# Altium project cm4gateway.PrjPcb (part 1 of 2)
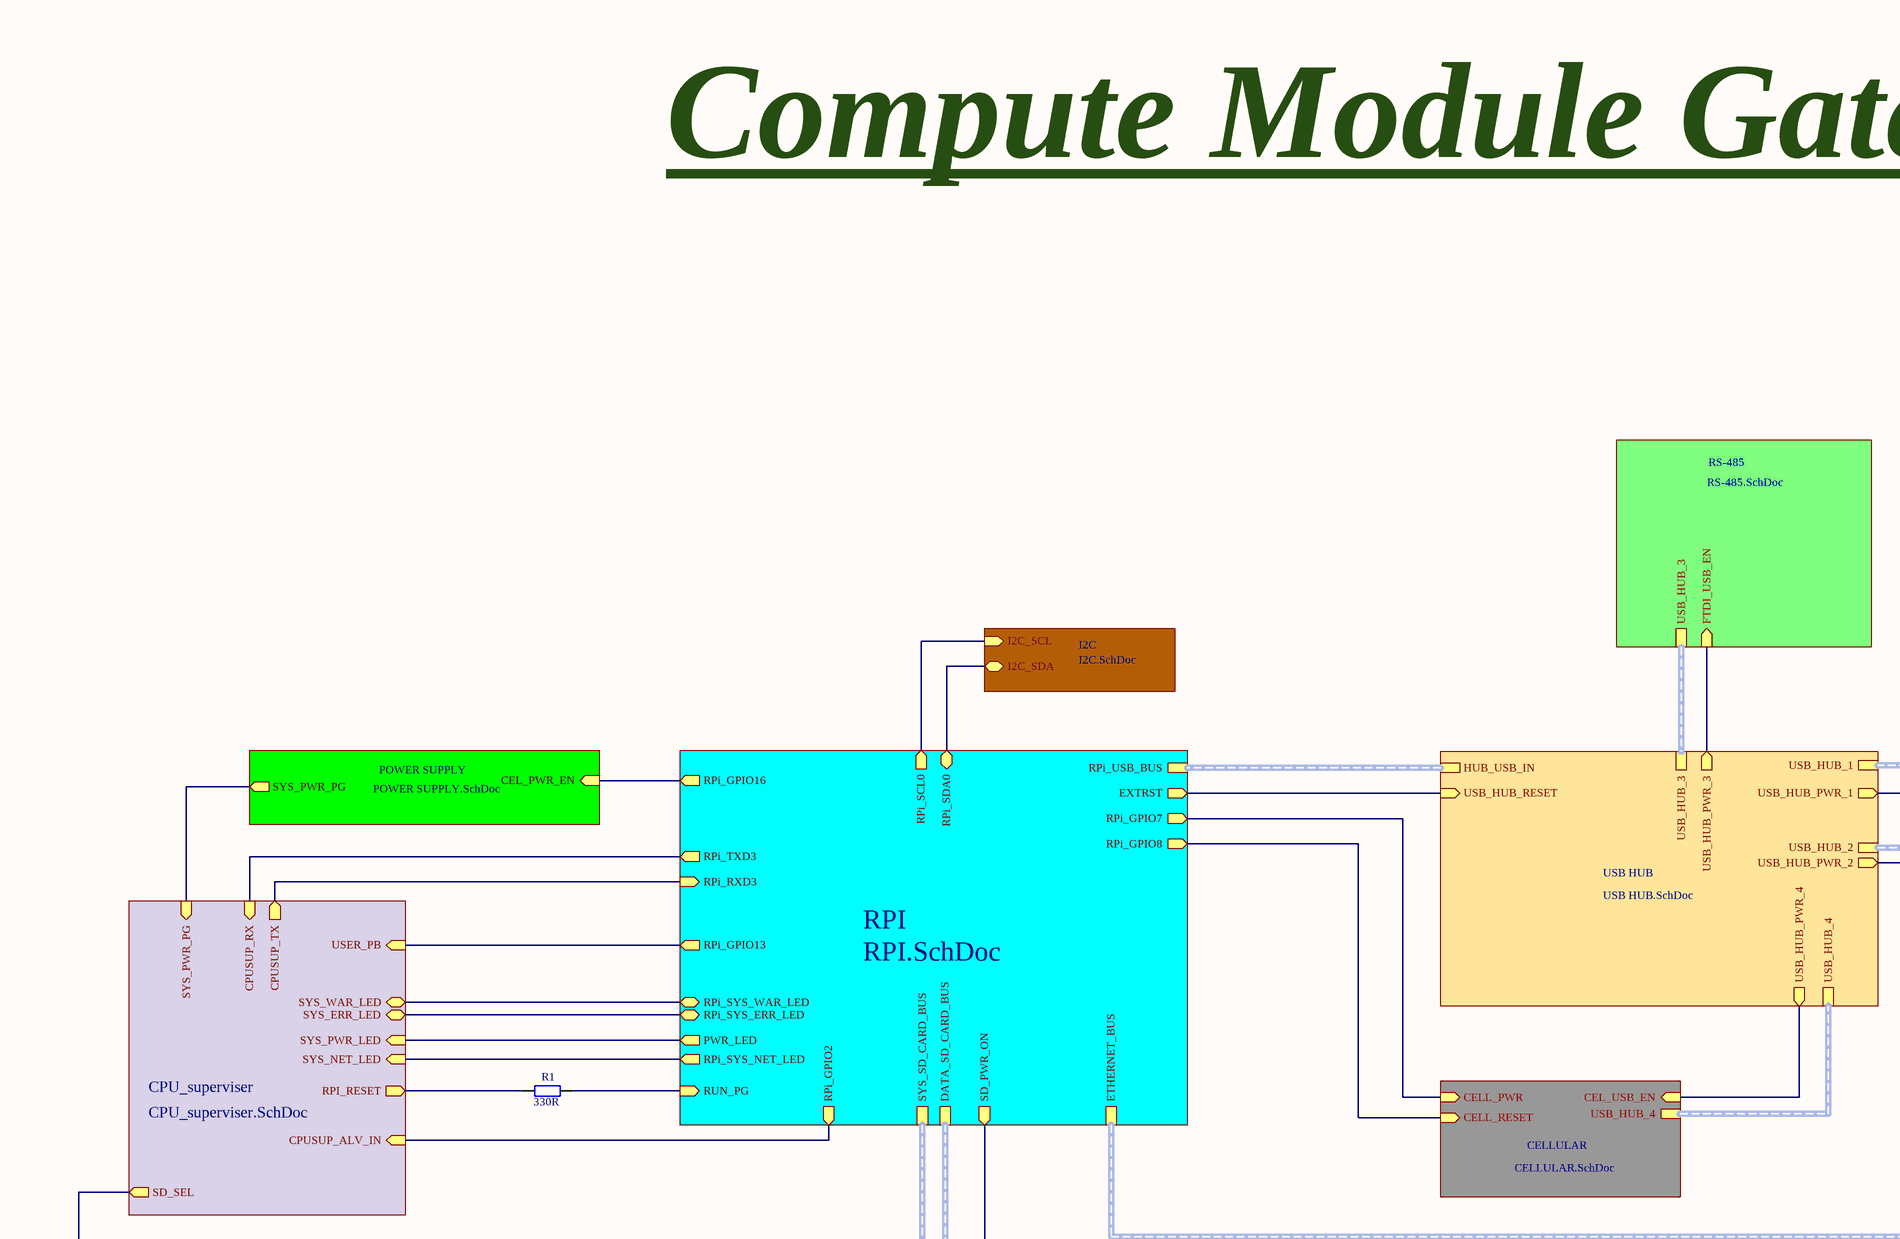
[diagram p0: cm4gateway.SchDoc, top left]
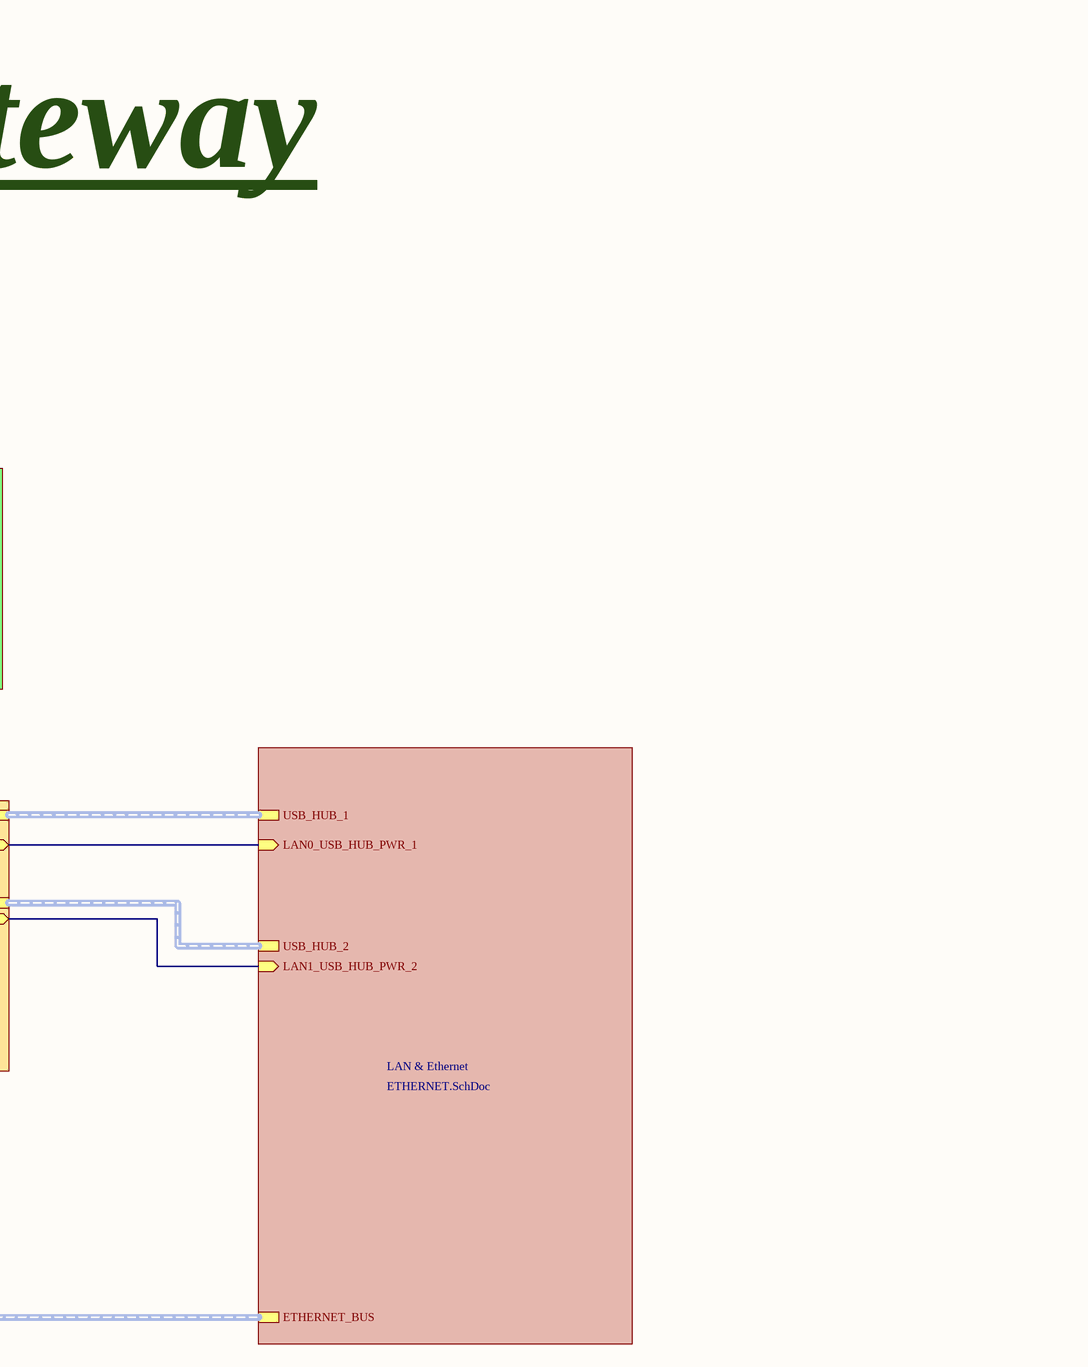
[diagram p1: cm4gateway.SchDoc, top right]
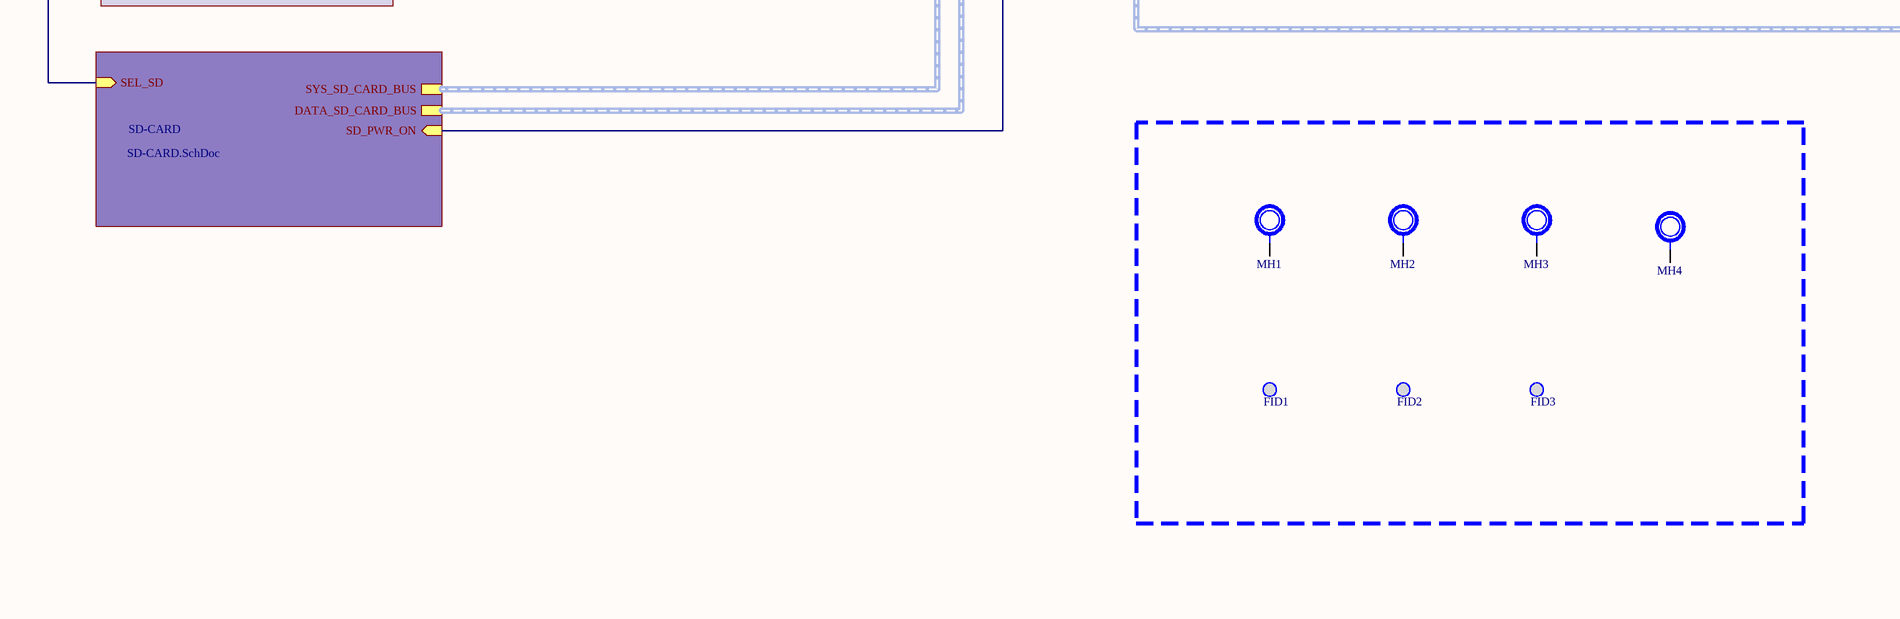
[diagram p2: cm4gateway.SchDoc, bottom left]
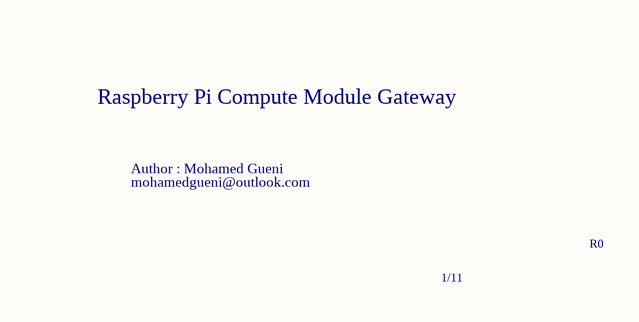
[diagram p3: cm4gateway.SchDoc, bottom right]
.Echelle: 1/1; .ENGINEER: M.GUENI; .PCB-TITLE: CM4G; .PCB Assembly Number: 1; .REVISION: R0
10 sheets, 359 parts. Net scope: hierarchical (ports join the sheet entries above them; power ports are global).
Board file: cm4gateway.PcbDoc
Sheets:
  cm4gateway.SchDoc
    CELLULAR = CELLULAR.SchDoc
    USB HUB = USB HUB.SchDoc
    POWER SUPPLY = POWER SUPPLY.SchDoc
    RS-485 = RS-485.SchDoc
    SD-CARD = SD-CARD.SchDoc
    CPU_superviser = CPU_superviser.SchDoc
    RPI = RPI.SchDoc
    I2C = I2C.SchDoc
    LAN & Ethernet = ETHERNET.SchDoc

## Sheet cm4gateway.SchDoc
size D

### Parts
FID1  Fiducial  [FIDUCIAL-1MM]  (value not drawn)
FID2  Fiducial  [FIDUCIAL-1MM]  (value not drawn)
FID3  Fiducial  [FIDUCIAL-1MM]  (value not drawn)
MH1  MH  [MH]  (value not drawn)
MH2  MH  [MH]  (value not drawn)
MH3  MH  [MH]  (value not drawn)
MH4  MH  [MH]  (value not drawn)
R1  Value 1: 330R  [RESC1608N]  (hidden comment: Resistor)

### Sub-sheets
CELLULAR = CELLULAR.SchDoc: USB_HUB_4 (harness USB_HUB_4), CEL_USB_EN (in), CELL_PWR (in), CELL_RESET (in)
CPU_superviser = CPU_superviser.SchDoc: CPUSUP_RX (in), CPUSUP_TX (out), USER_PB (in), SYS_ERR_LED (bidir), SYS_WAR_LED (bidir), CPUSUP_ALV_IN (in), RPI_RESET (out), SYS_PWR_PG (in), SD_SEL (out), SYS_PWR_LED (in), SYS_NET_LED (in)
I2C = I2C.SchDoc: I2C_SCL (in), I2C_SDA (bidir)
LAN & Ethernet = ETHERNET.SchDoc: USB_HUB_1 (harness USB_HUB_1), LAN0_USB_HUB_PWR_1 (in), USB_HUB_2 (harness USB_HUB_2), LAN1_USB_HUB_PWR_2 (in), ETHERNET_BUS (harness ETHERNET_BUS)
POWER SUPPLY = POWER SUPPLY.SchDoc: CEL_PWR_EN (in), SYS_PWR_PG (out)
RPI = RPI.SchDoc: RPi_GPIO13 (out), RPi_SYS_WAR_LED (bidir), RPi_SYS_ERR_LED (bidir), PWR_LED (out), RPi_SYS_NET_LED (out), ETHERNET_BUS (harness ETHERNET_BUS), SD_PWR_ON (out), RPi_RXD3 (in), RPi_TXD3 (out), RPi_GPIO2 (out), RUN_PG (in), RPi_GPIO16 (out), RPi_USB_BUS (harness RPi_USB_BUS), EXTRST (out), RPi_GPIO8 (out), RPi_GPIO7 (out), RPi_SDA0 (bidir), RPi_SCL0 (out), DATA_SD_CARD_BUS (harness DATA_SD_CARD_BUS), SYS_SD_CARD_BUS (harness SYS_SD_CARD_BUS)
RS-485 = RS-485.SchDoc: USB_HUB_3 (harness USB_HUB_3), FTDI_USB_EN (in)
SD-CARD = SD-CARD.SchDoc: SYS_SD_CARD_BUS (harness SYS_SD_CARD_BUS), DATA_SD_CARD_BUS (harness DATA_SD_CARD_BUS), SD_PWR_ON (in), SEL_SD (in)
USB HUB = USB HUB.SchDoc: HUB_USB_IN (harness RPi_USB_BUS), USB_HUB_RESET (in), USB_HUB_1 (harness USB_HUB_1), USB_HUB_PWR_1 (out), USB_HUB_2 (harness USB_HUB_2), USB_HUB_PWR_2 (out), USB_HUB_3 (harness USB_HUB_3), USB_HUB_PWR_3 (out), USB_HUB_4 (harness USB_HUB_4), USB_HUB_PWR_4 (out)

### Nets
I2C_SCL: sheet RPI/RPi_SCL0, sheet I2C/I2C_SCL
I2C_SDA: sheet RPI/RPi_SDA0, sheet I2C/I2C_SDA
RESET_IN: sheet USB HUB/USB_HUB_RESET, sheet RPI/EXTRST
SEL_SD: sheet SD-CARD/SEL_SD, sheet CPU_superviser/SD_SEL
SYS_ERR_LED: sheet CPU_superviser/SYS_ERR_LED, sheet RPI/RPi_SYS_ERR_LED
SYS_NET_LED: sheet CPU_superviser/SYS_NET_LED, sheet RPI/RPi_SYS_NET_LED
SYS_PWR_LED: sheet CPU_superviser/SYS_PWR_LED, sheet RPI/PWR_LED
SYS_WAR_LED: sheet CPU_superviser/SYS_WAR_LED, sheet RPI/RPi_SYS_WAR_LED
USER_PB: sheet CPU_superviser/USER_PB, sheet RPI/RPi_GPIO13
NetQ1_6: R1.1 ; sheet CPU_superviser/RPI_RESET
NetR1_2: R1.2 ; sheet RPI/RUN_PG
NetR4_1: sheet POWER SUPPLY/CEL_PWR_EN, sheet RPI/RPi_GPIO16
NetR15_2: sheet POWER SUPPLY/SYS_PWR_PG, sheet CPU_superviser/SYS_PWR_PG
NetR43_1: sheet USB HUB/USB_HUB_PWR_3, sheet RS-485/FTDI_USB_EN
NetR60_2: sheet SD-CARD/SD_PWR_ON, sheet RPI/SD_PWR_ON
NetR101_2: sheet CELLULAR/CEL_USB_EN, sheet USB HUB/USB_HUB_PWR_4
NetR103_2: sheet CELLULAR/CELL_PWR, sheet RPI/RPi_GPIO7
NetR105_2: sheet CELLULAR/CELL_RESET, sheet RPI/RPi_GPIO8
NetTP37_1: sheet CPU_superviser/CPUSUP_RX, sheet RPI/RPi_TXD3
NetTP38_1: sheet CPU_superviser/CPUSUP_TX, sheet RPI/RPi_RXD3
NetU17_12: sheet USB HUB/USB_HUB_PWR_1, sheet LAN & Ethernet/LAN0_USB_HUB_PWR_1
NetU17_16: sheet USB HUB/USB_HUB_PWR_2, sheet LAN & Ethernet/LAN1_USB_HUB_PWR_2
NetU19_14: sheet CPU_superviser/CPUSUP_ALV_IN, sheet RPI/RPi_GPIO2

Not connected (* = marked no-connect by the designer): MH1 MH; MH2 MH; MH3 MH; MH4 MH

### Buses and harness runs
harness sheet CELLULAR/USB_HUB_4 = sheet USB HUB/USB_HUB_4
harness sheet LAN & Ethernet/ETHERNET_BUS = sheet RPI/ETHERNET_BUS
harness sheet LAN & Ethernet/USB_HUB_1 = sheet USB HUB/USB_HUB_1
harness sheet LAN & Ethernet/USB_HUB_2 = sheet USB HUB/USB_HUB_2
harness sheet RPI/DATA_SD_CARD_BUS = sheet SD-CARD/DATA_SD_CARD_BUS
harness sheet RPI/RPi_USB_BUS = sheet USB HUB/HUB_USB_IN
harness sheet RPI/SYS_SD_CARD_BUS = sheet SD-CARD/SYS_SD_CARD_BUS
harness sheet RS-485/USB_HUB_3 = sheet USB HUB/USB_HUB_3

### Notes on the sheet
- Compute Module Gateway
- Raspberry Pi Compute Module Gateway
- Author : Mohamed Gueni
- mohamedgueni@outlook.com
- 1/11
- R0
- DWG. NO.
- REV.
- SHT.
- REVISION
- DESCRIPTION
- DATE
- APPROVED
- THIS DOCUMENT AND THE DATA DISCLOSED HEREIN OR HEREWITH IS THE PROPERTY OF ALTIUM LIMITED AND MAY BE FREELY DISTRIBUTED IN WHOLE. NO RIGHTS ARE RESERVED OR EXPRESS OR IMPLIED WARANTEE GIVEN.
- ENG:
- DSN:
- APPROVALS
- PROJECT
- DOCUMENT REVISION:
- DESIGN ITEM:
- CHK:
- BOM:
- REFERENCE DOCUMENTS
- PROJECT REVISION:
- TITLE
- FAB DWG:
- PCB DWG:
- ASSY DWG:
- SCALE:
- SIZE
- C
- CAGE CODE
- FILE NAME
- DWG NO.
- SHEET
- OF
- REV

### Library data of the parts
FID1-FID3 = MIS-000000003: MAN: _; Value 1: 1mm; Part Number: MIS-000000003; MANREF: _; DES: _; Value 2: _; TOL: _; FTP: _; SUP: _; SUPREF: _; NOTE: _
MH1-MH4 = MIS-000000004: MAN: _; Part Number: MIS-000000004; MANREF: _; DES: _; Value 1: _; Value 2: _; TOL: _; NOTE: _
R1 = RES-000000008: MAN: KOA Speer; SUP: Mouser; NOTE: _; Part Number: RES-000000008

## Sheet CELLULAR.SchDoc
size A3
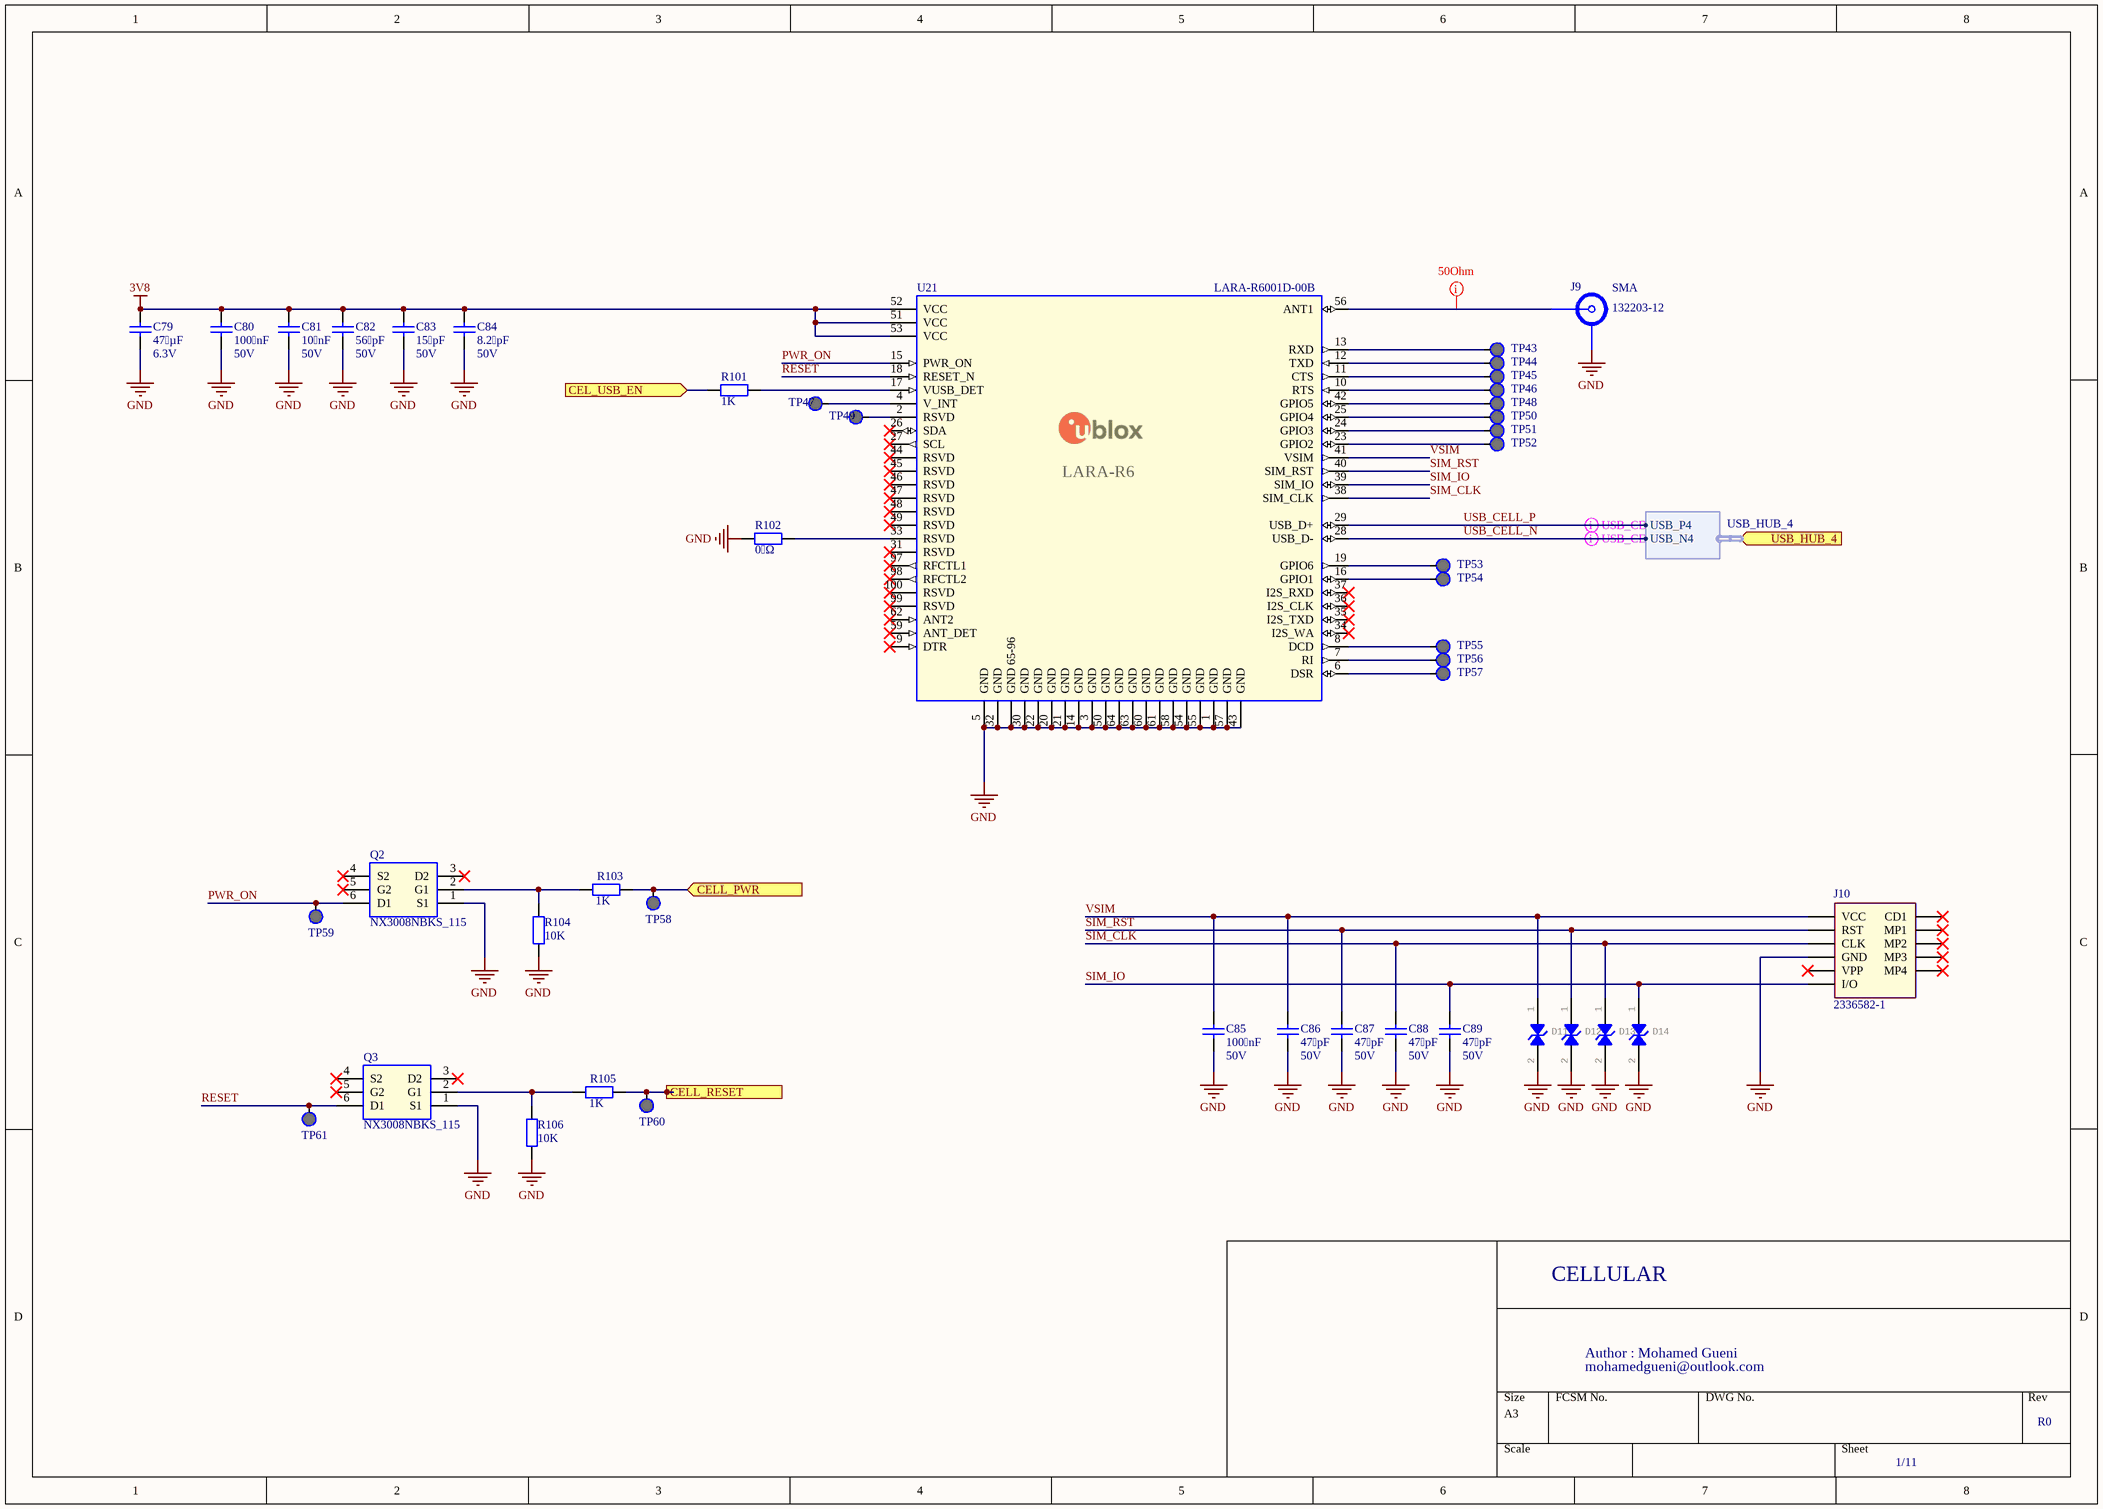
[diagram p4: CELLULAR.SchDoc]

### Parts
C79  Value 1: 47 µF  Value 2: 6.3V  [CAPC1210]  (hidden comment: T491D476K006AT)
C80  Value 1: 100 nF  Value 2: 50V  [CAPC1608N]  (hidden comment: GRM188R71H104KA93D)
C81  Value 1: 10 nF  Value 2: 50V  [CAPC1608N]  (hidden comment: GRM188R71H103KA01D)
C82  Value 1: 56 pF  Value 2: 50V  [CAPC402]  (hidden comment: KGM05ACG1H560KH)
C83  Value 1: 15 pF  Value 2: 50V  [CAPC1608N]  (hidden comment: GRM1885C1H150JA01D)
C84  Value 1: 8.2 pF  Value 2: 50V  [CAPC402]  (hidden comment: GRM1555C1H8R2CA01D)
C85  Value 1: 100 nF  Value 2: 50V  [CAPC1608N]  (hidden comment: GRM188R71H104KA93D)
C86  Value 1: 47 pF  Value 2: 50V  [CAPC402]  (hidden comment: C0402C470J5GAC)
C87  Value 1: 47 pF  Value 2: 50V  [CAPC402]  (hidden comment: C0402C470J5GAC)
C88  Value 1: 47 pF  Value 2: 50V  [CAPC402]  (hidden comment: C0402C470J5GAC)
C89  Value 1: 47 pF  Value 2: 50V  [CAPC402]  (hidden comment: C0402C470J5GAC)
D11  CDSOD323-T12LC  [CDSOD323T12LC]  (value not drawn)
D12  CDSOD323-T12LC  [CDSOD323T12LC]  (value not drawn)
D13  CDSOD323-T12LC  [CDSOD323T12LC]  (value not drawn)
D14  CDSOD323-T12LC  [CDSOD323T12LC]  (value not drawn)
J9  132203-12  [13220312]
J10  2336582-1  [23365821]
Q2  NX3008NBKS_115  [SOT65P210X110-6N]
Q3  NX3008NBKS_115  [SOT65P210X110-6N]
R101  Value 1: 1K  [RESC1608N]  (hidden comment: RN731JTTD1001F25)
R102  Value 1: 0 Ω  [RESC1608N]  (hidden comment: RMCF0603ZT0R00)
R103  Value 1: 1K  [RESC1608N]  (hidden comment: Resistor)
R104  Value 1: 10K  [RESC1608N]  (hidden comment: Resistor)
R105  Value 1: 1K  [RESC1608N]  (hidden comment: Resistor)
R106  Value 1: 10K  [RESC1608N]  (hidden comment: Resistor)
TP43  Test Point  [TP]  (value not drawn)  (no BOM)
TP44  Test Point  [TP]  (value not drawn)  (no BOM)
TP45  Test Point  [TP]  (value not drawn)  (no BOM)
TP46  Test Point  [TP]  (value not drawn)  (no BOM)
TP47  Test Point  [TP]  (value not drawn)  (no BOM)
TP48  Test Point  [TP]  (value not drawn)  (no BOM)
TP49  Test Point  [TP]  (value not drawn)  (no BOM)
TP50  Test Point  [TP]  (value not drawn)  (no BOM)
TP51  Test Point  [TP]  (value not drawn)  (no BOM)
TP52  Test Point  [TP]  (value not drawn)  (no BOM)
TP53  Test Point  [TP]  (value not drawn)  (no BOM)
TP54  Test Point  [TP]  (value not drawn)  (no BOM)
TP55  Test Point  [TP]  (value not drawn)  (no BOM)
TP56  Test Point  [TP]  (value not drawn)  (no BOM)
TP57  Test Point  [TP]  (value not drawn)  (no BOM)
TP58  Test Point  [TP]  (value not drawn)  (no BOM)
TP59  Test Point  [TP]  (value not drawn)  (no BOM)
TP60  Test Point  [TP]  (value not drawn)  (no BOM)
TP61  Test Point  [TP]  (value not drawn)  (no BOM)
U21  LARA-R6001D-00B  [LARA-R6]

### Ports
CEL_USB_EN (in), CELL_PWR (in), CELL_RESET (in), USB_HUB_4 (in, harness USB_HUB_4)

### Harnesses
USB_HUB_4: USB_P4, USB_N4

### Nets
3V8: C79.2 C80.1 C81.2 C82.2 C83.2 C84.2 U21.51(VCC) U21.52(VCC) U21.53(VCC)
GND: C79.1 C80.2 C81.1 C82.1 C83.1 C84.1 C85.2 C86.1 C87.1 C88.1 C89.1 D11.2 D12.2 D13.2 D14.2 J9.1,2,3,4 J10.C5(GND) Q2.1(S1) Q3.1(S1) R102.2 R104.1 R106.1 U21.1(GND) U21.3(GND) U21.5(GND) U21.14(GND) U21.20(GND) U21.21(GND) U21.22(GND) U21.30(GND) U21.32(GND) U21.43(GND) U21.50(GND) U21.54(GND) U21.55(GND) U21.57(GND) U21.58(GND) U21.60(GND) U21.61(GND) U21.63(GND) U21.64(GND) U21.65(GND_65-96)
PWR_ON: Q2.6(D1) TP59.1 U21.15(PWR_ON)
RESET: Q3.6(D1) TP61.1 U21.18(RESET_N)
SIM_CLK: C88.2 D13.1 J10.C3(CLK) U21.38(SIM_CLK)
SIM_IO: C89.2 D14.1 J10.C7(I/O) U21.39(SIM_IO)
SIM_RST: C87.2 D12.1 J10.C2(RST) U21.40(SIM_RST)
USB_CELL_N: U21.28(USB_D-) ; port USB_HUB_4.USB_N4  [project net _D4_N]
USB_CELL_P: U21.29(USB_D+) ; port USB_HUB_4.USB_P4  [project net _D4_P]
VSIM: C85.1 C86.2 D11.1 J10.C1(VCC) U21.41(VSIM)
NetJ9_5: J9.5 U21.56(ANT1)
NetQ2_2: Q2.2(G1) R103.1 R104.2
NetQ3_2: Q3.2(G1) R105.1 R106.2
NetR101_1: R101.1 U21.17(VUSB_DET)
NetR101_2: R101.2 ; port CEL_USB_EN
NetR102_1: R102.1 U21.33(RSVD)
NetR103_2: R103.2 TP58.1 ; port CELL_PWR
NetR105_2: R105.2 TP60.1 ; port CELL_RESET
NetTP43_1: TP43.1 U21.13(RXD)
NetTP44_1: TP44.1 U21.12(TXD)
NetTP45_1: TP45.1 U21.11(CTS)
NetTP46_1: TP46.1 U21.10(RTS)
NetTP47_1: TP47.1 U21.4(V_INT)
NetTP48_1: TP48.1 U21.42(GPIO5)
NetTP49_1: TP49.1 U21.2(RSVD)
NetTP50_1: TP50.1 U21.25(GPIO4)
NetTP51_1: TP51.1 U21.24(GPIO3)
NetTP52_1: TP52.1 U21.23(GPIO2)
NetTP53_1: TP53.1 U21.19(GPIO6)
NetTP54_1: TP54.1 U21.16(GPIO1)
NetTP55_1: TP55.1 U21.8(DCD)
NetTP56_1: TP56.1 U21.7(RI)
NetTP57_1: TP57.1 U21.6(DSR)

Not connected (* = marked no-connect by the designer): J10 C6(VPP)* CD1* MP1* MP2* MP3* MP4*; Q2 3(D2)* 4(S2)* 5(G2)*; Q3 3(D2)* 4(S2)* 5(G2)*; U21 9(DTR)* 26(SDA)* 27(SCL)* 31(RSVD)* 34(I2S_WA)* 35(I2S_TXD)* 36(I2S_CLK)* 37(I2S_RXD)* 44(RSVD)* 45(RSVD)* 46(RSVD)* 47(RSVD)* 48(RSVD)* 49(RSVD)* 59(ANT_DET)* 62(ANT2)* 97(RFCTL1)* 98(RFCTL2)* 99(RSVD)* 100(RSVD)*

### Layout directives
mark named 50Ohm: NetJ9_5
differential pair; differential pair class USB_CELL_DIFFPAIR: _D4_N, _D4_P

### Notes on the sheet
- (near J9) SMA
- CELLULAR
- Author : Mohamed Gueni
- mohamedgueni@outlook.com
- R0
- 1/11

### Library data of the parts
C79 = CAP-000000029: MAN: KEMET; DES: Tantalum Capacitor, 47 µF, 6.3V, 1210; FTP: 1210; SUPREF: 581-T491D476K006AT; Part Number: CAP-000000029; MANREF: T491D476K006AT
C80 C85 = CAP-000000017: MAN: Murata; DES: Ceramic Capacitor, 100 nF, 50V, X7R, 0603; FTP: 603; SUPREF: 81-GRM188R71H104KA93D; Part Number: CAP-000000017; MANREF: GRM188R71H104KA93D
C81 = CAP-000000028: MAN: Murata; DES: Ceramic Capacitor, 10 nF, 50V, X7R, 0603; FTP: 603; SUPREF: 81-GRM188R71H103KA01D; Part Number: CAP-000000028; MANREF: GRM188R71H103KA01D
C82 = CAP-000000015: MAN: KYOCERA AVX; DES: Ceramic Capacitor, 56 pF, 50V, C0G, 0402; FTP: 402; SUPREF: 581-KGM05ACG1H560KH; Part Number: CAP-000000015; MANREF: KGM05ACG1H560KH
C83 = CAP-000000014: MAN: Murata; DES: Ceramic Capacitor, 15 pF, 50V, C0G, 0603; FTP: 603; SUPREF: 81-GRM1885C1H150JA01D; Part Number: CAP-000000014; MANREF: GRM1885C1H150JA01D
C84 = CAP-000000013: MAN: Murata; DES: Ceramic Capacitor, 8.2 pF, 50V, C0G, 0402; FTP: 402; SUPREF: 81-GRM1555C1H8R2CA01D; Part Number: CAP-000000013; MANREF: GRM1555C1H8R2CA01D
C86-C89 = CAP-000000012: MAN: KEMET; DES: Ceramic Capacitor, 47 pF, 50V, C0G, 0402; FTP: 402; SUPREF: 80-C0402C470J5GAC; Part Number: CAP-000000012; MANREF: C0402C470J5GAC
D11-D14 = TVS-000000003: MAN: Bourns; DES: ESD Protection Diodes / TVS Diodes Bidirectional Ultra Low Cap; Value 1: 12 V; Value 2: 11 A; TOL: _; FTP: SOD-323-2; SUP: Mouser; SUPREF: 652-CDSOD323-T12LC; Part Number: TVS-000000003; MANREF: CDSOD323-T12LC; NOTE: _
J9 = CON-000000014: MAN: Amphenol RF; DES: SMA Right-Angle Jack PCB THT Connector, 50Ω, 12.4GHz; FTP: THT; SUP: Mouser; SUPREF: 523-132203-12; Part Number: CON-000000014; MANREF: 132203-12
J10 = CON-000000015: 4FF SIM, Push-Push Type, 7 Position, 7 Loaded Positions, Signal, -40  80 C [-40  185 F], SIM Card Connectors; Manufacturer_Name: TE Connectivity; Geometry.Height: 1.62mm; DES: SIMM Connectors PUSH-PUSH NANO SIM CONNECTOR; FTP: SMT; SUP: Mouser; SUPREF: 571-2336582-1; Mouser Part Number: *; Mouser Price/Stock: *; Manufacturer_Part_Number: 2336582-1; Datasheet Link: https://www.te.com/en/product-2336582-1.html; Part Number: CON-000000015; MAN: TE Connectivity; MANREF: 2336582-1
Q2 Q3 = TRM-000000002: MAN: Nexperia; MANREF: NX3008NBKS,115; DES: MOSFETs 30 V, 350 mA dual N-channel Trench MOSFET; Value 1: 350 mA; Value 2: 30V; TOL: _; FTP: TSSOP-6; SUP: Mouser; SUPREF: 771-NX3008NBKS,115; Part Number: TRM-000000002; NOTE: -
R101 = RES-000000001: MAN: KOA Speer; DES: Thin Film Resistors - SMD 1kOhm,0603,1%,25ppm, 63mW,50V; Value 2: 0.63W; TOL: 1%; FTP: 0603; SUP: Mouser; SUPREF: 660-RN731JTTD1001F25; NOTE: _; Part Number: RES-000000001; MANREF: RN731JTTD1001F25
R102 = RES-0000000017: MAN: Stackpole Electronics; DES: Thick Film Resistor, 0 Ω (Jumper), 100 mW, 0603; TOL: 1%; FTP: 0603; SUP: Mouser; SUPREF: 71-CRCW06030000Z0EA; NOTE: _; Part Number: RES-0000000017; MANREF: RMCF0603ZT0R00
R103 R105 = RES-000000001: MAN: KOA Speer; MANREF: RN731JTTD1001F25; DES: Thin Film Resistors - SMD 1kOhm,0603,1%,25ppm, 63mW,50V; Value 2: 0.63W; TOL: 1%; FTP: 0603; SUP: Mouser; SUPREF: 660-RN731JTTD1001F25; NOTE: _; Part Number: RES-000000001
R104 R106 = RES-000000007: MAN: KOA Speer; MANREF: RN731JTTD1002F25; DES: Thin Film Resistors - SMD 10kOhm,0603,1%,25ppm ,63mW,50V; Value 2: 0.63W; TOL: 1%; FTP: 0603; SUP: Mouser; SUPREF: 660-RN731JTTD1002F25; NOTE: _; Part Number: RES-000000007
TP43-TP61 = MIS-000000002: MAN: _; Part Number: MIS-000000002; MANREF: _; DES: _; Value 1: _; Value 2: _; TOL: _; FTP: _; SUP: _; SUPREF: _; NOTE: _
U21 = GIC-000000015: MAN: u-blox; DES: Mobile Modules LTE/3G/GSM-Global-Data only B1,2,3,4,5,7,8,12,13,18,19,20,26,28 LGA, 24x26 mm, 150 pcs/ree; TOL: _; SUP: Mouser; SUPREF: 377-LARA-R6001D-00B; Part Number: GIC-000000015; MANREF: LARA-R6001D-00B; NOTE: _

## Sheet USB HUB.SchDoc: USB HUB 1X4
size A3; Engineer: M.GUENI; Revision: R0; SheetNumber: 07; SheetTotal: 10
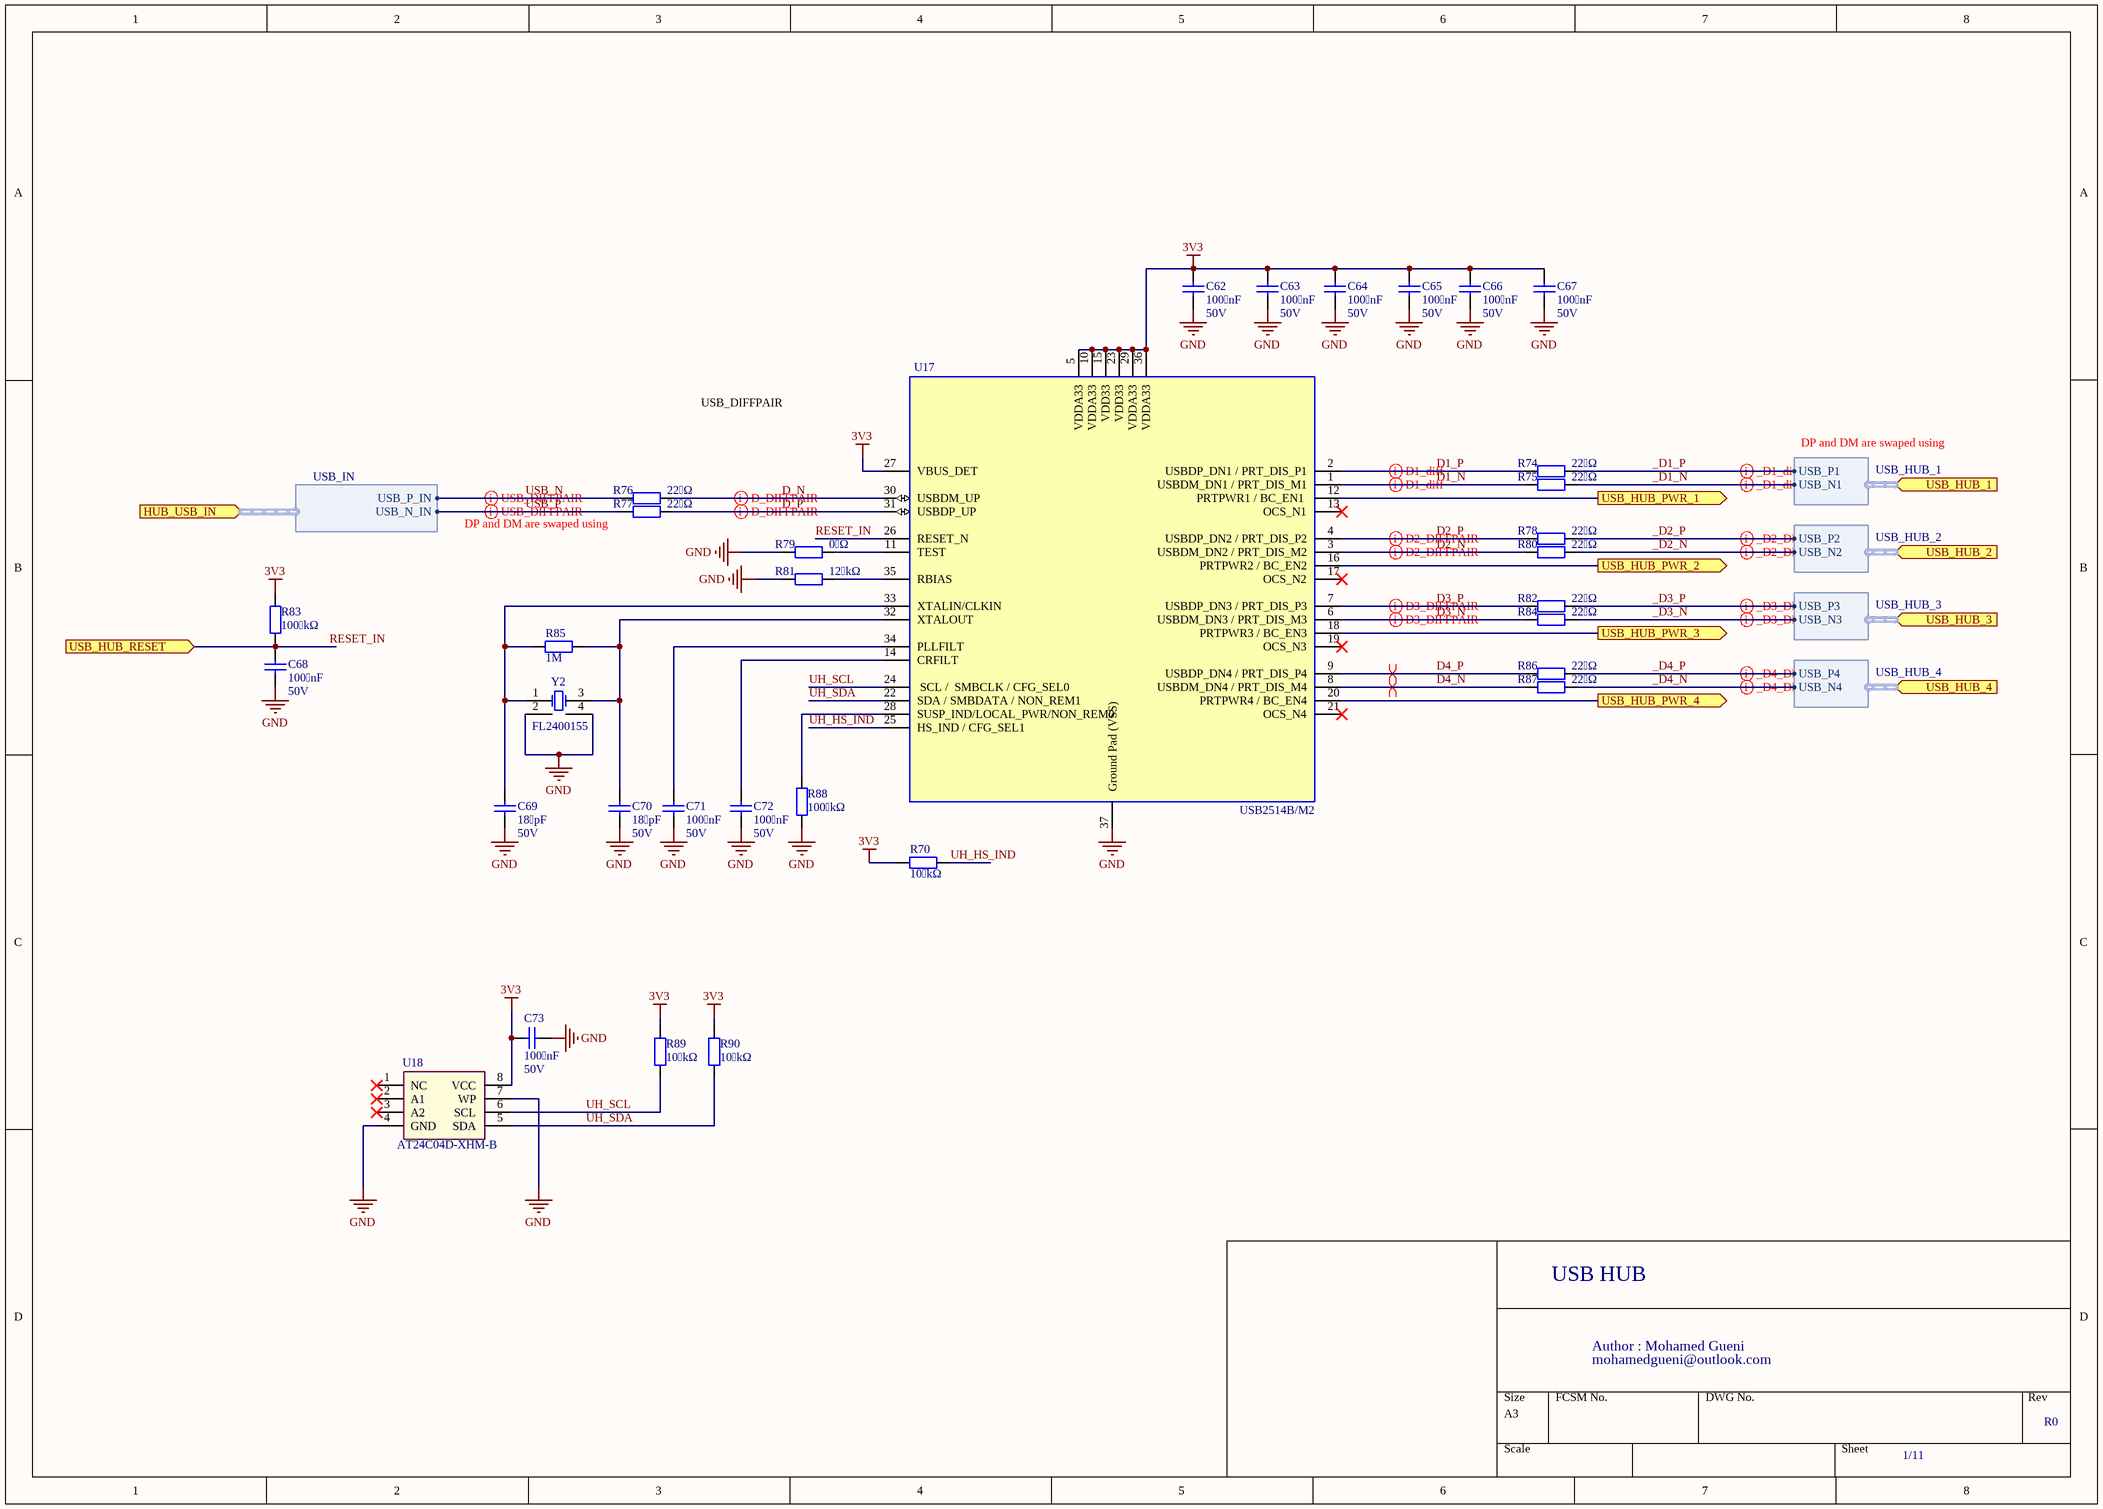
[diagram p5: USB HUB.SchDoc]

### Parts
C62  Value 1: 100 nF  Value 2: 50V  [CAPC1608N]  (hidden comment: GRM188R71H104KA93D)
C63  Value 1: 100 nF  Value 2: 50V  [CAPC1608N]  (hidden comment: GRM188R71H104KA93D)
C64  Value 1: 100 nF  Value 2: 50V  [CAPC1608N]  (hidden comment: GRM188R71H104KA93D)
C65  Value 1: 100 nF  Value 2: 50V  [CAPC1608N]  (hidden comment: GRM188R71H104KA93D)
C66  Value 1: 100 nF  Value 2: 50V  [CAPC1608N]  (hidden comment: GRM188R71H104KA93D)
C67  Value 1: 100 nF  Value 2: 50V  [CAPC1608N]  (hidden comment: GRM188R71H104KA93D)
C68  Value 1: 100 nF  Value 2: 50V  [CAPC1608N]  (hidden comment: GRM188R71H104KA93D)
C69  Value 1: 18 pF  Value 2: 50V  [CAPC1608N]  (hidden comment: GRM1885C1H180JA01D)
C70  Value 1: 18 pF  Value 2: 50V  [CAPC1608N]  (hidden comment: GRM1885C1H180JA01D)
C71  Value 1: 100 nF  Value 2: 50V  [CAPC1608N]  (hidden comment: GRM188R71H104KA93D)
C72  Value 1: 100 nF  Value 2: 50V  [CAPC1608N]  (hidden comment: GRM188R71H104KA93D)
C73  Value 1: 100 nF  Value 2: 50V  [CAPC1608N]  (hidden comment: GRM188R71H104KA93D)
R70  Value 1: 10 kΩ  [RESC1608N]  (hidden comment: CPF0603B10KE)
R74  Value 1: 22 Ω  [RESC1608N]  (hidden comment: ERJ-3EKF22R0V)
R75  Value 1: 22 Ω  [RESC1608N]  (hidden comment: ERJ-3EKF22R0V)
R76  Value 1: 22 Ω  [RESC1608N]  (hidden comment: ERJ-3EKF22R0V)
R77  Value 1: 22 Ω  [RESC1608N]  (hidden comment: ERJ-3EKF22R0V)
R78  Value 1: 22 Ω  [RESC1608N]  (hidden comment: ERJ-3EKF22R0V)
R79  Value 1: 0 Ω  [RESC1608N]  (hidden comment: RMCF0603ZT0R00)
R80  Value 1: 22 Ω  [RESC1608N]  (hidden comment: ERJ-3EKF22R0V)
R81  Value 1: 12 kΩ  [RESC1608N]  (hidden comment: ERJ-3EKF1202V)
R82  Value 1: 22 Ω  [RESC1608N]  (hidden comment: ERJ-3EKF22R0V)
R83  Value 1: 100 kΩ  [RESC1608N]  (hidden comment: TNPW0603100KBEA)
R84  Value 1: 22 Ω  [RESC1608N]  (hidden comment: ERJ-3EKF22R0V)
R85  Value 1: 1M  [RESC1608N]
R86  Value 1: 22 Ω  [RESC1608N]  (hidden comment: ERJ-3EKF22R0V)
R87  Value 1: 22 Ω  [RESC1608N]  (hidden comment: ERJ-3EKF22R0V)
R88  Value 1: 100 kΩ  [RESC1608N]  (hidden comment: TNPW0603100KBEA)
R89  Value 1: 10 kΩ  [RESC1608N]  (hidden comment: CPF0603B10KE)
R90  Value 1: 10 kΩ  [RESC1608N]  (hidden comment: CPF0603B10KE)
U17  USB2514B/M2  [SQFN-36]
U18  AT24C04D-XHM-B  [TSSOP-8AT24C04D-XHM-B]
Y2  FL2400155  [FL2400155]

### Ports
HUB_USB_IN (in, harness USB_IN), USB_HUB_1 (in, harness USB_HUB_1), USB_HUB_2 (in, harness USB_HUB_2), USB_HUB_3 (in, harness USB_HUB_3), USB_HUB_4 (in, harness USB_HUB_4), USB_HUB_PWR_1 (out), USB_HUB_PWR_2 (out), USB_HUB_PWR_3 (out), USB_HUB_PWR_4 (out), USB_HUB_RESET (in)

### Harnesses
USB_IN: USB_P_IN, USB_N_IN
USB_HUB_1: USB_N1, USB_P1
USB_HUB_2: USB_P2, USB_N2
USB_HUB_3: USB_P3, USB_N3
USB_HUB_4: USB_P4, USB_N4

### Nets
3V3: C62.2 C63.2 C64.2 C65.2 C66.2 C67.2 C73.2 R70.2 R83.1 R89.1 R90.1 U17.5(VDDA33) U17.10(VDDA33) U17.15(VDD33) U17.23(VDD33) U17.27(VBUS_DET) U17.29(VDDA33) U17.36(VDDA33) U18.8(VCC)
GND: C62.1 C63.1 C64.1 C65.1 C66.1 C67.1 C68.1 C69.1 C70.1 C71.1 C72.1 C73.1 R79.2 R81.2 R88.2 U17.37(Ground_Pad_(VSS)) U18.4(GND) U18.7(WP) Y2.2(Case1) Y2.4(Case2)
_D1_N: R75.1 ; port USB_HUB_1.USB_N1
_D1_P: R74.1 ; port USB_HUB_1.USB_P1
_D2_N: R80.1 ; port USB_HUB_2.USB_N2
_D2_P: R78.1 ; port USB_HUB_2.USB_P2
_D3_N: R84.1 ; port USB_HUB_3.USB_N3
_D3_P: R82.1 ; port USB_HUB_3.USB_P3
_D4_N: R87.1 ; port USB_HUB_4.USB_N4
_D4_P: R86.1 ; port USB_HUB_4.USB_P4
D1_N: R75.2 U17.1(USBDM_DN1_/_PRT_DIS_M1)
D1_P: R74.2 U17.2(USBDP_DN1_/_PRT_DIS_P1)
D2_N: R80.2 U17.3(USBDM_DN2_/_PRT_DIS_M2)
D2_P: R78.2 U17.4(USBDP_DN2_/_PRT_DIS_P2)
D3_N: R84.2 U17.6(USBDM_DN3_/_PRT_DIS_M3)
D3_P: R82.2 U17.7(USBDP_DN3_/_PRT_DIS_P3)
D4_N: R87.2 U17.8(USBDM_DN4_/_PRT_DIS_M4)
D4_P: R86.2 U17.9(USBDP_DN4_/_PRT_DIS_P4)
D_N: R76.1 U17.30(USBDM_UP)
D_P: R77.1 U17.31(USBDP_UP)
RESET_IN: C68.2 R83.2 U17.26(RESET_N) ; port USB_HUB_RESET
UH_HS_IND: R70.1 U17.25(HS_IND_/_CFG_SEL1)
UH_SCL: R89.2 U17.24(SCL_/__SMBCLK_/_CFG_SEL0) U18.6(SCL)
UH_SDA: R90.2 U17.22(SDA_/_SMBDATA_/_NON_REM1) U18.5(SDA)
USB_N: R76.2 ; port HUB_USB_IN.USB_P_IN
USB_P: R77.2 ; port HUB_USB_IN.USB_N_IN
NetC69_2: C69.2 R85.2 U17.33(XTALIN/CLKIN) Y2.1(OSC1)
NetC70_2: C70.2 R85.1 U17.32(XTALOUT) Y2.3
NetC71_2: C71.2 U17.34(PLLFILT)
NetC72_2: C72.2 U17.14(CRFILT)
NetR43_1: U17.18(PRTPWR3_/_BC_EN3) ; port USB_HUB_PWR_3
NetR79_1: R79.1 U17.11(TEST)
NetR81_1: R81.1 U17.35(RBIAS)
NetR88_1: R88.1 U17.28(SUSP_IND/LOCAL_PWR/NON_REM0)
NetR101_2: U17.20(PRTPWR4_/_BC_EN4) ; port USB_HUB_PWR_4
NetU17_12: U17.12(PRTPWR1_/_BC_EN1) ; port USB_HUB_PWR_1
NetU17_16: U17.16(PRTPWR2_/_BC_EN2) ; port USB_HUB_PWR_2

Not connected (* = marked no-connect by the designer): U17 13(OCS_N1)* 17(OCS_N2)* 19(OCS_N3)* 21(OCS_N4)*; U18 1(NC)* 2(A1)* 3(A2)*

### Layout directives
differential pair; differential pair class D_DIFFPAIR: D_N, D_P
differential pair; differential pair class USB_DIFFPAIR: USB_N, USB_P
differential pair; differential pair class D1_diff: D1_N, D1_P
differential pair; differential pair class D2_DIFFPAIR: D2_N, D2_P
differential pair; differential pair class _D2_DIFFPAIR: _D2_N, _D2_P
differential pair; differential pair class D3_DIFFPAIR: D3_N, D3_P
differential pair; differential pair class _D3_DIFFPAIR: _D3_N, _D3_P
differential pair: D4_N, D4_P
differential pair; differential pair class _D4_DIFFPAIR: _D4_N, _D4_P
differential pair; differential pair class _D1_diff: _D1_N, _D1_P

### Notes on the sheet
- USB_DIFFPAIR
- DP and DM are swaped using
- USB HUB
- Author : Mohamed Gueni
- mohamedgueni@outlook.com
- 1/11
- R0
- Title:
- Micro Device Tunisie
- Size:
- Date:
- File:
- A3
- Engineer :
- Revision:
- Sheet
- of
- Cyber Parc  Hammam Sousse
- Avenue Charles De Gaulle
- 4011, Hammam-Sousse, Tunisie
- contact@mdtunisie.com

### Library data of the parts
C62-C68 C71-C73 = CAP-000000017: as C80 on sheet CELLULAR; Part Number: CAP-000000017; MANREF: GRM188R71H104KA93D
C69 C70 = CAP-000000030: MAN: Murata; DES: Ceramic Capacitor, 18 pF, 50V, C0G, 0603; FTP: 603; SUPREF: 81-GRM1885C1H180JA01D; Part Number: CAP-000000030; MANREF: GRM1885C1H180JA01D
R70 R89 R90 = RES-0000000012: MAN: TE Connectivity; DES: Thin Film Resistor, 10 kΩ, 1%, 62.5 mW, 0603; TOL: 1%; FTP: 0603; SUP: Mouser; SUPREF: 279-CMF0603F1002FHEK; NOTE: _; Part Number: RES-0000000012; MANREF: CPF0603B10KE
R74-R78 R80 R82 R84 R86 R87 = RES-0000000019: MAN: Panasonic; DES: Thick Film Resistor, 22 Ω, 1%, 200 mW, 0603; TOL: 1%; FTP: 0603; SUP: Mouser; SUPREF: 667-ERJ-3EKF22R0V; NOTE: _; Part Number: RES-0000000019; MANREF: ERJ-3EKF22R0V
R79 = RES-0000000017: as R102 on sheet CELLULAR; Part Number: RES-0000000017; MANREF: RMCF0603ZT0R00
R81 = RES-0000000011: MAN: Panasonic; DES: Thick Film Resistor, 12 kΩ, 1%, 200 mW, 0603; TOL: 1%; FTP: 0603; SUP: Mouser; SUPREF: 667-ERJ-3EKF1202V; NOTE: _; Part Number: RES-0000000011; MANREF: ERJ-3EKF1202V
R83 R88 = RES-0000000013: MAN: Vishay / Dale; DES: Thin Film Resistor, 100 kΩ, 1%, 125 mW, 0603; TOL: 1%; FTP: 0603; SUP: Mouser; SUPREF: 71-CRCW0603100KFKEA; NOTE: _; Part Number: RES-0000000013; MANREF: TNPW0603100KBEA
R85 = RES-000000011: FTP: 0603; SUP: Mouser; NOTE: _; Part Number: RES-000000011
U17 = GIC-000000002: MAN: Microchip Technology; DES: USB Interface IC 4-Port USB 2.0 Hi-Speed Hub Cont; Value 1: 3.3 V; Value 2: 70 mA; TOL: _; SUP: Mouser; SUPREF: 579-USB2514B/M2; Part Number: GIC-000000002; MANREF: USB2514B/M2; FTP: SQFN-36; NOTE: _
U18 = GIC-000000011: MAN: Microchip Technology; DES: EEPROM 1.7-3.6V, 1MHz, Ind Tmp, 8-TSSOP; Value 1: 3.6 V; Value 2: _; FTP: TSSOP-8; SUP: Mouser; SUPREF: 556-AT24C04D-XHM-B; Part Number: GIC-000000011; MANREF: AT24C04D-XHM-B; TOL: _; NOTE: _
Y2 = Y-000000003: MAN: Diodes Incorporated; DES: Crystals Crystal Ceramic SEAM3225 T&R 3K; Value 1: 24 MHz; Value 2: 27 pF; TOL: 30 PPM; SUP: Mouser; SUPREF: 729-FL2400155; NOTE: _; Part Number: Y-000000003; MANREF: FL2400155

## Sheet POWER SUPPLY.SchDoc: POWER SUPPLY
size A3; Engineer: M.GUENI; Revision: R0; SheetNumber: 02; SheetTotal: 10
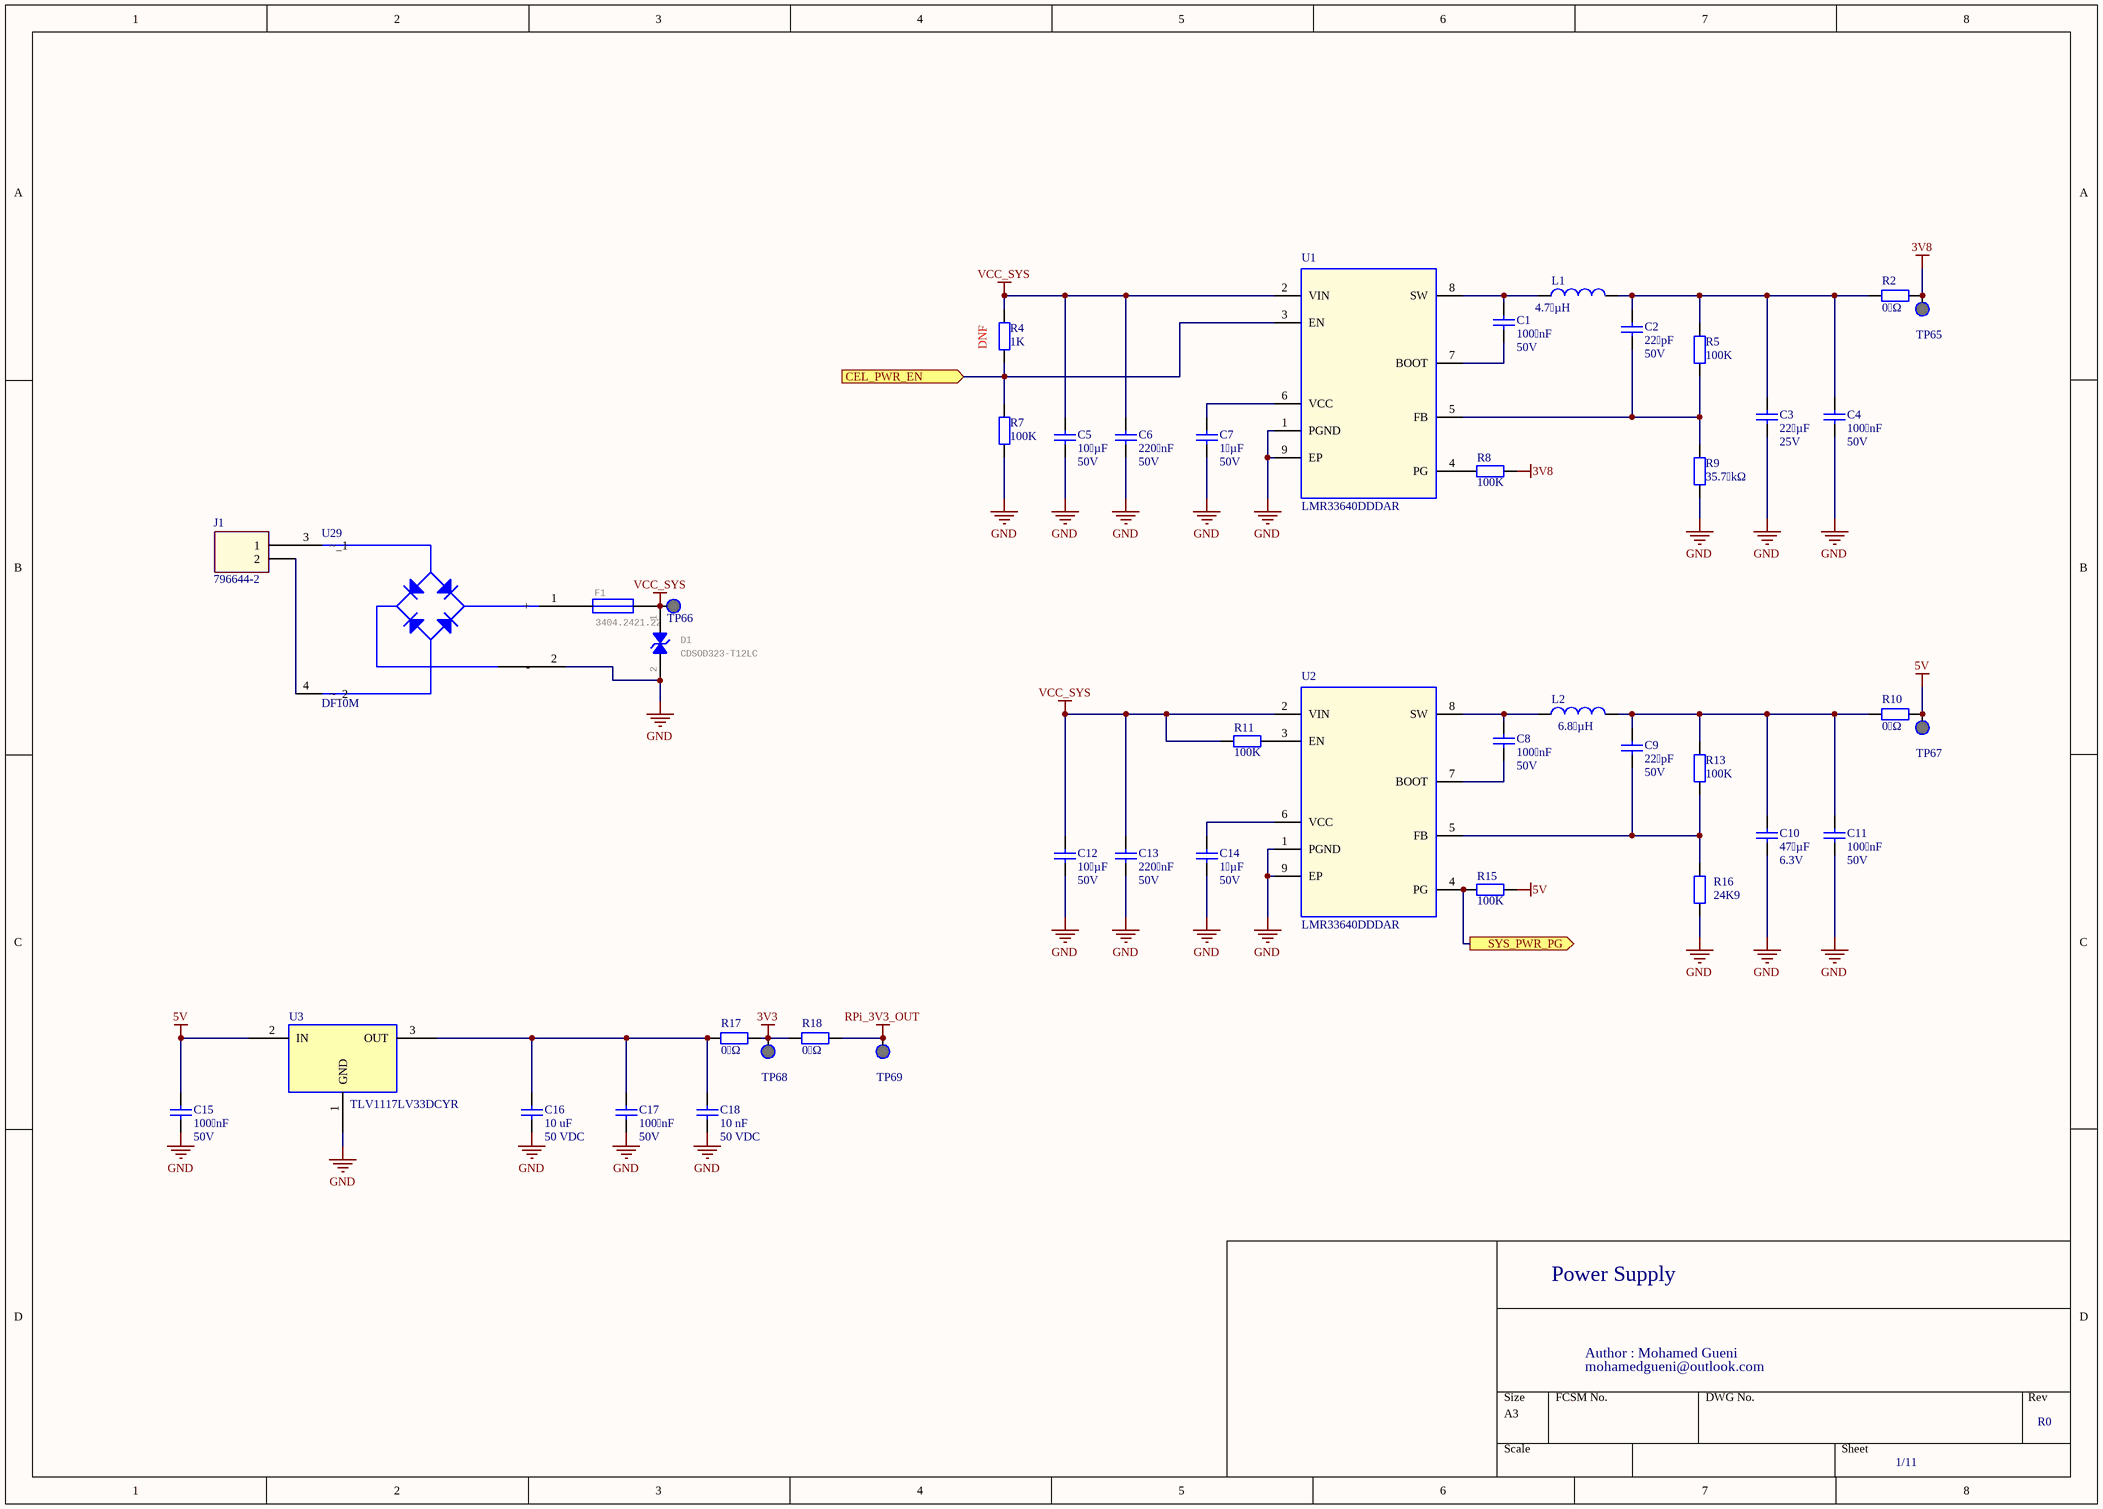
[diagram p6: POWER SUPPLY.SchDoc]

### Parts
C1  Value 1: 100 nF  Value 2: 50V  [CAPC1608N]  (hidden comment: Capacitor)
C2  Value 1: 22 pF  Value 2: 50V  [CAPC1608N]  (hidden comment: Capacitor)
C3  Value 1: 22 µF  Value 2: 25V  [CAPC1608N]  (hidden comment: Capacitor)
C4  Value 1: 100 nF  Value 2: 50V  [CAPC1608N]  (hidden comment: Capacitor)
C5  Value 1: 10 µF  Value 2: 50V  [CAPC1608N]  (hidden comment: Capacitor)
C6  Value 1: 220 nF  Value 2: 50V  [CAPC1608N]  (hidden comment: Capacitor)
C7  Value 1: 1 µF  Value 2: 50V  [CAPC1608N]  (hidden comment: Capacitor)
C8  Value 1: 100 nF  Value 2: 50V  [CAPC1608N]  (hidden comment: Capacitor)
C9  Value 1: 22 pF  Value 2: 50V  [CAPC1608N]  (hidden comment: Capacitor)
C10  Value 1: 47 µF  Value 2: 6.3V  [CAPC1210]  (hidden comment: T491D476K006AT)
C11  Value 1: 100 nF  Value 2: 50V  [CAPC1608N]  (hidden comment: Capacitor)
C12  Value 1: 10 µF  Value 2: 50V  [CAPC1608N]  (hidden comment: Capacitor)
C13  Value 1: 220 nF  Value 2: 50V  [CAPC1608N]  (hidden comment: Capacitor)
C14  Value 1: 1 µF  Value 2: 50V  [CAPC1608N]  (hidden comment: Capacitor)
C15  Value 1: 100 nF  Value 2: 50V  [CAPC1608N]  (hidden comment: Capacitor)
C16  Value 1: 10 uF  Value 2: 50 VDC  [CAPC1608N]  (hidden comment: GRM188R61E106MA73D)
C17  Value 1: 100 nF  Value 2: 50V  [CAPC1608N]  (hidden comment: Capacitor)
C18  Value 1: 10 nF  Value 2: 50 VDC  [CAPC1608N]  (hidden comment: C0603C103J5RACTU)
D1  CDSOD323-T12LC  [CDSOD323T12LC]
F1  3404.2421.22  [3404242122]
J1  796644-2  [7966442]
L1  Value 1: 4.7 µH  [1.5uH-XAL4020]  (hidden comment: XGL4030-472MEC)
L2  Value 1: 6.8 µH  [1.5uH-XAL4020]  (hidden comment: NRS4018T6R8MDGJ)
R2  Value 1: 0 Ω  [RESC1608N]  (hidden comment: Resistor)
R4  Value 1: 1K  [RESC1608N]  (hidden comment: Resistor)
R5  Value 1: 100K  [RESC1608N]  (hidden comment: Resistor)
R7  Value 1: 100K  [RESC1608N]  (hidden comment: Resistor)
R8  Value 1: 100K  [RESC1608N]  (hidden comment: Resistor)
R9  Value 1: 35.7 kΩ  [RESC1608N]  (hidden comment: Resistor)
R10  Value 1: 0 Ω  [RESC1608N]  (hidden comment: Resistor)
R11  Value 1: 100K  [RESC1608N]  (hidden comment: Resistor)
R13  Value 1: 100K  [RESC1608N]  (hidden comment: Resistor)
R15  Value 1: 100K  [RESC1608N]  (hidden comment: Resistor)
R16  Value 1: 24K9  [RESC1608N]  (hidden comment: RN731JTTD2492F25)
R17  Value 1: 0 Ω  [RESC1608N]  (hidden comment: Resistor)
R18  Value 1: 0 Ω  [RESC1608N]  (hidden comment: Resistor)
TP65  Test Point  [TP]  (value not drawn)  (no BOM)
TP66  Test Point  [TP]  (value not drawn)  (no BOM)
TP67  Test Point  [TP]  (value not drawn)  (no BOM)
TP68  Test Point  [TP]  (value not drawn)  (no BOM)
TP69  Test Point  [TP]  (value not drawn)  (no BOM)
U1  LMR33640DDDAR  [SOIC127P600X170-9N]
U2  LMR33640DDDAR  [SOIC127P600X170-9N]
U3  TLV1117LV33DCYR  [SOT-223-4]
U29  DF10M  [621-DF10M]

### Ports
CEL_PWR_EN (in), SYS_PWR_PG (out)

### Nets
3V3: R17.2 R18.1 TP68.1
3V8: R2.2 R8.1 TP65.1
5V: C15.2 R10.2 R15.1 TP67.1 U3.2(IN)
GND: C3.1 C4.1 C5.1 C6.1 C7.1 C10.1 C11.1 C12.1 C13.1 C14.1 C15.1 C16.1 C17.1 C18.1 D1.2 R7.1 R9.1 R16.1 U1.1(PGND) U1.9(EP) U2.1(PGND) U2.9(EP) U3.1(GND) U29.2(-)
RPi_3V3_OUT: R18.2 TP69.1
VCC_SYS: C5.2 C6.2 C12.2 C13.2 D1.1 F1.2 R4.2 R11.2 TP66.1 U1.2(VIN) U2.2(VIN)
NetC1_1: C1.1 U1.7(BOOT)
NetC1_2: C1.2 L1.1 U1.8(SW)
NetC2_1: C2.1 R5.2 R9.2 U1.5(FB)
NetC2_2: C2.2 C3.2 C4.2 L1.2 R2.1 R5.1
NetC7_2: C7.2 U1.6(VCC)
NetC8_1: C8.1 U2.7(BOOT)
NetC8_2: C8.2 L2.1 U2.8(SW)
NetC9_1: C9.1 R13.2 R16.2 U2.5(FB)
NetC9_2: C9.2 C10.2 C11.2 L2.2 R10.1 R13.1
NetC14_2: C14.2 U2.6(VCC)
NetC16_2: C16.2 C17.2 C18.2 R17.1 U3.3(OUT)
NetF1_1: F1.1 U29.1(+)
NetJ1_1: J1.1 U29.3(~_1)
NetJ1_2: J1.2 U29.4(~_2)
NetR4_1: R4.1 R7.2 U1.3(EN) ; port CEL_PWR_EN
NetR8_2: R8.2 U1.4(PG)
NetR11_1: R11.1 U2.3(EN)
NetR15_2: R15.2 U2.4(PG) ; port SYS_PWR_PG

### Notes on the sheet
- (near R4) DNF
- Power Supply
- Author : Mohamed Gueni
- mohamedgueni@outlook.com
- R0
- 1/11
- Title:
- Micro Device Tunisie
- Size:
- Date:
- File:
- A3
- Engineer :
- Revision:
- Sheet
- of
- Cyber Parc  Hammam Sousse
- Avenue Charles De Gaulle
- 4011, Hammam-Sousse, Tunisie
- contact@mdtunisie.com

### Library data of the parts
C1 C4 C8 C11 C15 C17 = CAP-000000017: MAN: Murata; MANREF: GRM188R71H104KA93D; DES: Ceramic Capacitor, 100 nF, 50V, X7R, 0603; FTP: 603; SUPREF: 81-GRM188R71H104KA93D; Part Number: CAP-000000017
C2 C9 = CAP-000000027: MAN: Murata; MANREF: GRM1885C1H220JA01D; DES: Ceramic Capacitor, 22 pF, 50V, C0G, 0603; FTP: 603; SUPREF: 81-GRM1885C1H220JA01D; Part Number: CAP-000000027
C3 = CAP-000000024: MAN: Murata; MANREF: GRM188R61E226ME15D; DES: Ceramic Capacitor, 22 µF, 25V, X5R, 0603; FTP: 603; SUPREF: 81-GRM188R61E226ME15D; Part Number: CAP-000000024
C5 C12 = CAP-000000025: MAN: Murata; MANREF: GRM188R61H106KAALD; DES: Ceramic Capacitor, 10 µF, 50V, X5R, 0603; FTP: 603; SUPREF: 81-GRM188R61H106KAALD; Part Number: CAP-000000025
C6 C13 = CAP-000000026: MAN: Murata; MANREF: GRM188R71H224KA93D; DES: Ceramic Capacitor, 220 nF, 50V, X7R, 0603; FTP: 603; SUPREF: 81-GRM188R71H224KA93D; Part Number: CAP-000000026
C7 C14 = CAP-000000018: MAN: Murata; MANREF: GRM188R61H105KAALD; DES: Ceramic Capacitor, 1 µF, 50V, X5R, 0603; FTP: 603; SUPREF: 81-GRM188R61H105KAALD; Part Number: CAP-000000018
C10 = CAP-000000029: as C79 on sheet CELLULAR; Part Number: CAP-000000029; MANREF: T491D476K006AT
C16 = CAP-000000002: MAN: Murata Electronics; DES: Multilayer Ceramic Capacitors MLCC - SMD/SMT RECOMMENDED ALT 810-C3225X7R1H106250; TOL: 20 %; FTP: 0603; SUP: Mouser; SUPREF: 81-GRM188R61E106MA3D; NOTE: _; Part Number: CAP-000000002; MANREF: GRM188R61E106MA73D
C18 = CAP-000000006: MAN: KEMET; DES: Multilayer Ceramic Capacitors MLCC - SMD/SMT 50V 0.01uF 0603 X7R 5%; TOL: 5 %; FTP: 0603; SUP: Mouser; SUPREF: 80-C0603C103J5R; NOTE: _; Part Number: CAP-000000006; MANREF: C0603C103J5RACTU
D1 = TVS-000000003: as D11 on sheet CELLULAR; Part Number: TVS-000000003; MANREF: CDSOD323-T12LC; NOTE: _
F1 = FU-000000001: MAN: Schurter; DES: Surface Mount Fuses UMZ 250 FUSE WITH HOLDER 3.15A T; Value 1: 3.15 A; Value 2: 250 VAC; TOL: 200 A at 250 VAC, 100 A at 125 VDC; FTP: 11.1 mm x 4.2 mm; SUP: Mouser; SUPREF: 693-3404.2421.22; NOTE: _; Part Number: FU-000000001; MANREF: 3404.2421.22
J1 = CON-000000016: MAN: TE Connectivity; DES: SIMM Connectors PUSH-PUSH NANO SIM CONNECTOR; FTP: THT; SUP: Mouser; SUPREF: 571-796644-2; Part Number: CON-000000016; MANREF: 796644-2
L1 = IND-000000003: MAN: Coilcraft; DES: Fixed Inductors 1.5uH Shld 20% 7.5A 23.6mOhms AECQ2; FTP: 1616; SUP: Mouser; SUPREF: 994-XGL4030-472MEC; Part Number: IND-000000003; MANREF: XGL4030-472MEC
L2 = IND-000000005: MAN: TAIYO YUDEN; DES: Fixed Inductors 1.5uH Shld 20% 7.5A 23.6mOhms AECQ2; FTP: 1616; SUP: Mouser; SUPREF: 963-NRS4018T6R8MDGJ; Part Number: IND-000000005; MANREF: NRS4018T6R8MDGJ
R2 R10 R17 R18 = RES-0000000017: MAN: Stackpole Electronics; MANREF: RMCF0603ZT0R00; DES: Thick Film Resistor, 0 Ω (Jumper), 100 mW, 0603; TOL: 1%; FTP: 0603; SUP: Mouser; SUPREF: 71-CRCW06030000Z0EA; NOTE: _; Part Number: RES-0000000017
R4 = RES-000000001: as R103 on sheet CELLULAR; Part Number: RES-000000001
R5 R7 R8 R11 R13 R15 = RES-000000002: MAN: KOA Speer; MANREF: RN731JTTD1003F100; DES: Thin Film Resistors - SMD 0603 100 Kohms 1% 10PPM; Value 2: 0.63W; TOL: 1%; FTP: 0603; SUP: Mouser; SUPREF: 660-RN731JTD1003F100; NOTE: _; Part Number: RES-000000002
R9 = RES-0000000016: MAN: Panasonic; MANREF: ERJ-3EKF3572V; DES: Thick Film Resistor, 35.7 kΩ, 1%, 200 mW, 0603; TOL: 1%; FTP: 0603; SUP: Mouser; SUPREF: 667-ERJ-3EKF3572V; NOTE: _; Part Number: RES-0000000016
R16 = RES-000000003: MAN: KOA Speer; DES: Thin Film Resistors - SMD 24.9kOhm,0603,1%,25p pm,63mW,50V; Value 2: 0.63W; TOL: 1%; FTP: 0603; SUP: Mouser; SUPREF: 660-RN731JTTD2492F25; NOTE: _; Part Number: RES-000000003; MANREF: RN731JTTD2492F25
TP65-TP69 = MIS-000000002: MAN: _; Part Number: MIS-000000002; MANREF: _; DES: _; Value 1: _; Value 2: _; TOL: _; FTP: _; SUP: _; SUPREF: _; NOTE: _
U1 U2 = VRG-000000003: MAN: Texas Instruments; DES: Bridge Rectifiers 1000V 1A; Value 1: 1 V to 24 V; Value 2: 4 A; TOL: _; FTP: 621-DF10M; SUP: Mouser; SUPREF: 595-LMR33640DDDAR; Part Number: VRG-000000003; MANREF: LMR33640DDDAR; NOTE: -
U3 = VRG-000000001: MAN: Texas Instrument; DES: TEXAS INSTRUMENTS  TLV1117LV33DCYR  LDO FIXE 3.3V 1A SOT-223-4; Value 1: 3.3V; Value 2: 1A; TOL: _; FTP: SOT-223; SUP: Farnell; SUPREF: 2323647; Part Number: VRG-000000001; MANREF: TLV1117LV33DCYR; NOTE: -
U29 = VRG-000000002: MAN: Diodes Incorporated; DES: Bridge Rectifiers 1000V 1A; Value 1: 1 kV; Value 2: 1A; TOL: _; SUP: Mouser; Part Number: VRG-000000002; MANREF: DF10M; FTP: 621-DF10M; SUPREF: 621-DF10M; NOTE: -

## Sheet RS-485.SchDoc: RS-485
size A3; Engineer: M.GUENI; Revision: R0; SheetNumber: 05; SheetTotal: 10
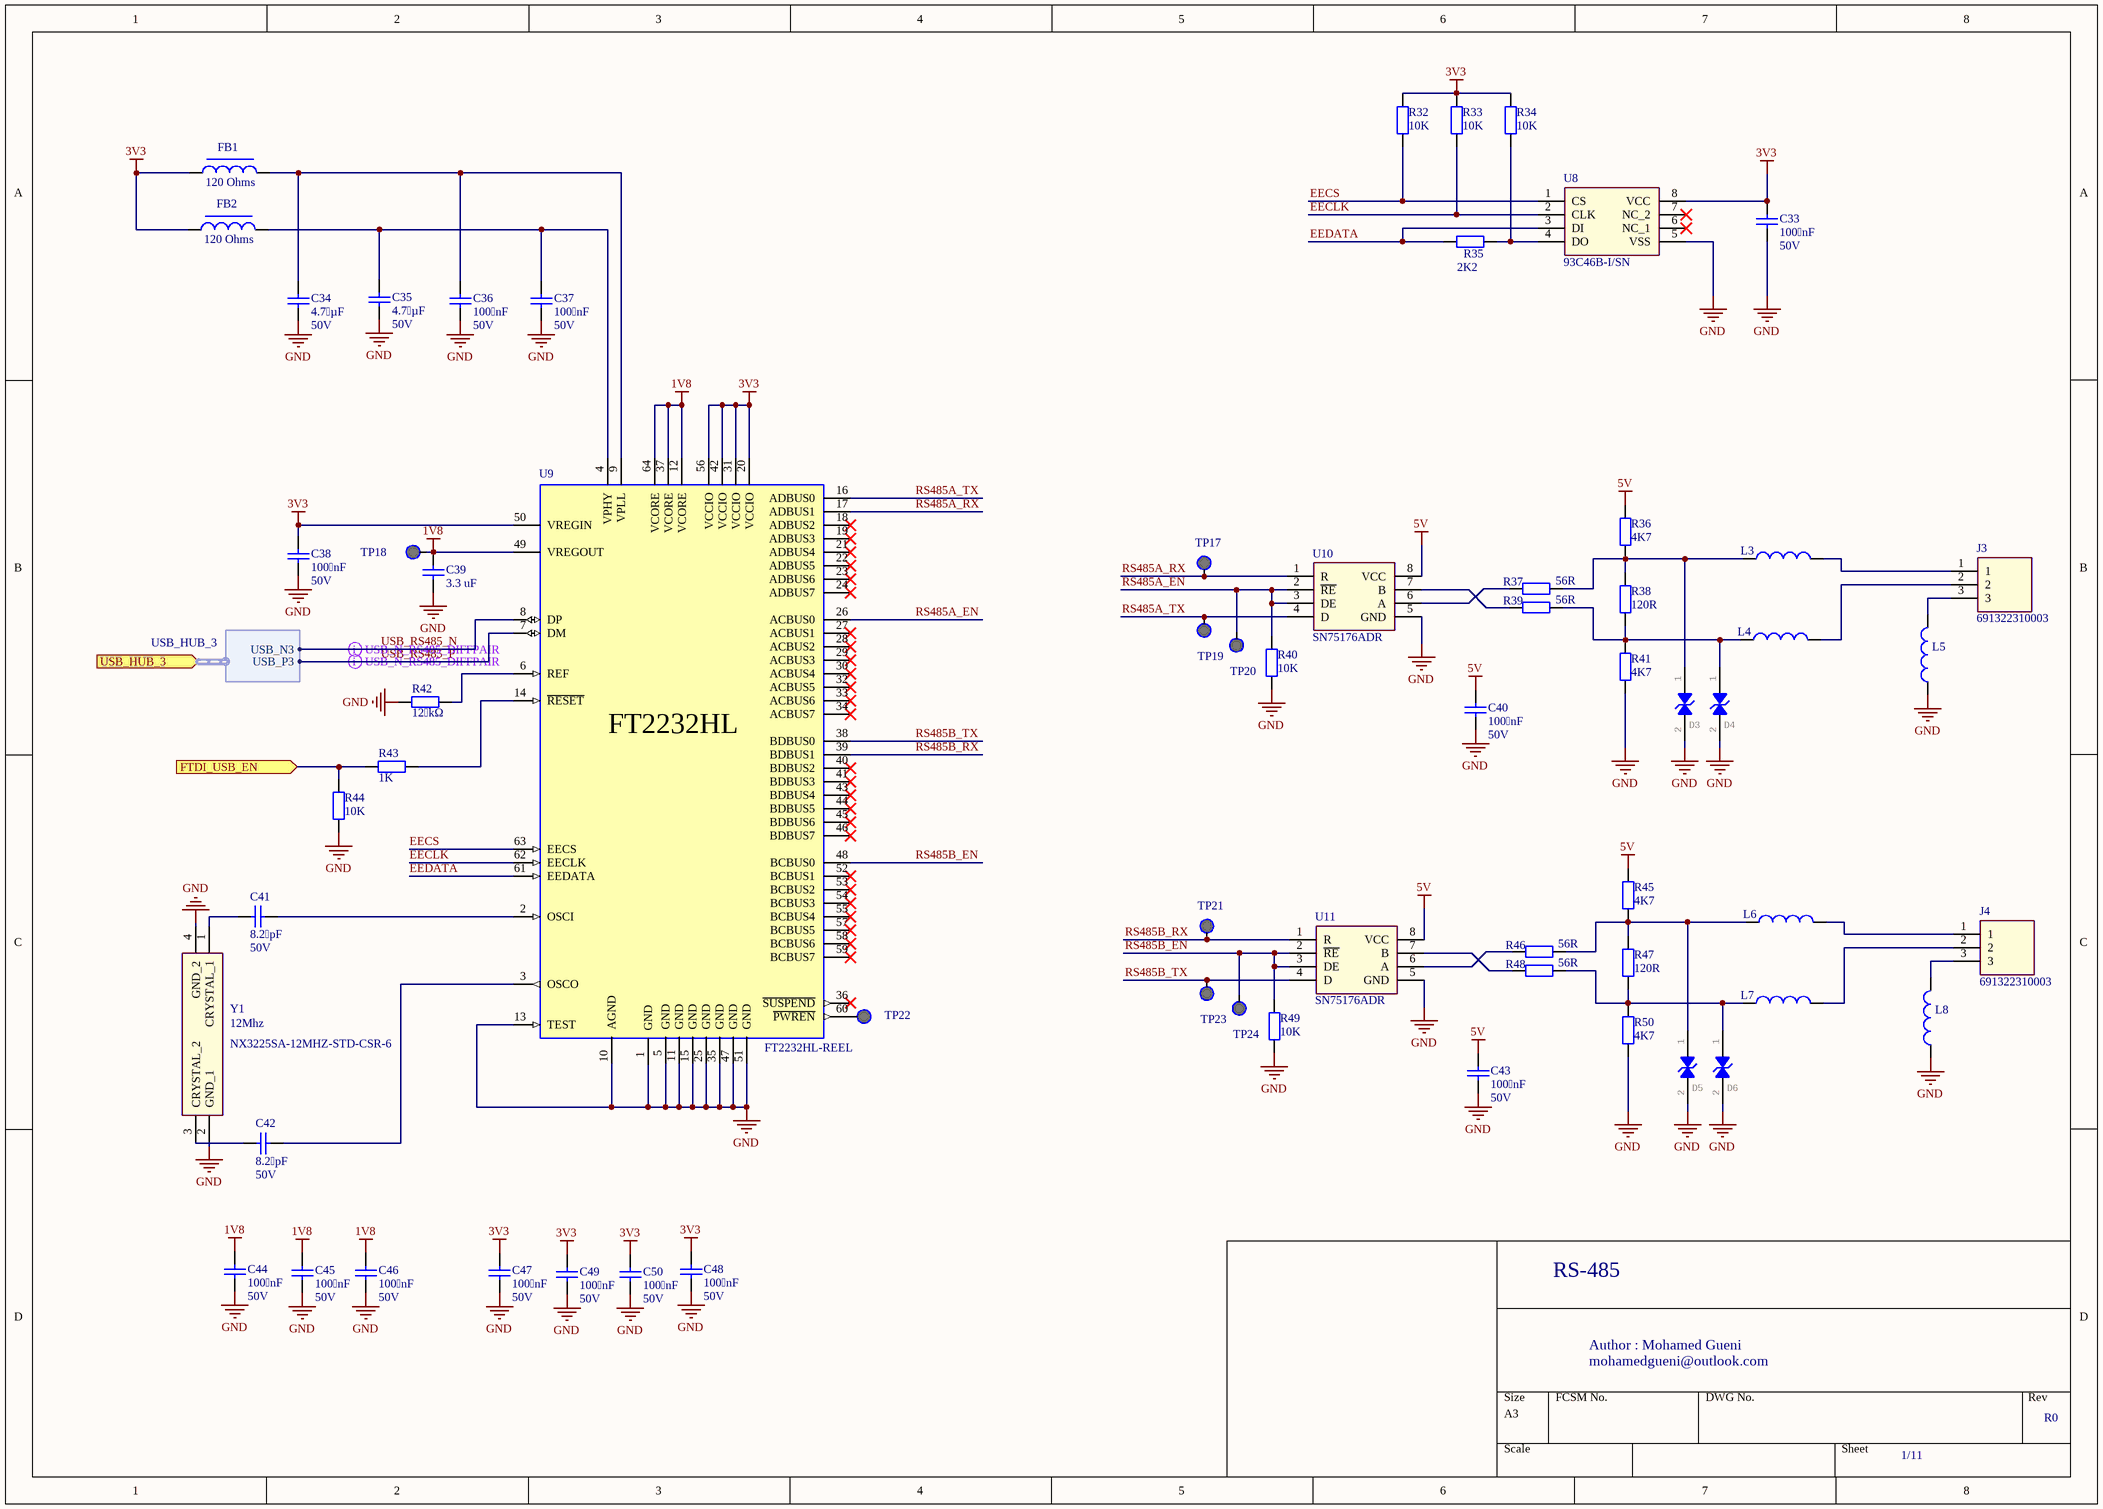
[diagram p7: RS-485.SchDoc]

### Parts
C33  Value 1: 100 nF  Value 2: 50V  [CAPC1608N]  (hidden comment: GRM188R71H104KA93D)
C34  Value 1: 4.7 µF  Value 2: 50V  [CAPC1608N]  (hidden comment: GRM188R61H475KE11D)
C35  Value 1: 4.7 µF  Value 2: 50V  [CAPC1608N]  (hidden comment: GRM188R61H475KE11D)
C36  Value 1: 100 nF  Value 2: 50V  [CAPC1608N]  (hidden comment: GRM188R71H104KA93D)
C37  Value 1: 100 nF  Value 2: 50V  [CAPC1608N]  (hidden comment: GRM188R71H104KA93D)
C38  Value 1: 100 nF  Value 2: 50V  [CAPC1608N]  (hidden comment: GRM188R71H104KA93D)
C39  Value 1: 3.3 uF  [CAPC1608N]
C40  Value 1: 100 nF  Value 2: 50V  [CAPC1608N]  (hidden comment: GRM188R71H104KA93D)
C41  Value 1: 8.2 pF  Value 2: 50V  [CAPC402]  (hidden comment: GRM1555C1H8R2CA01D)
C42  Value 1: 8.2 pF  Value 2: 50V  [CAPC402]  (hidden comment: GRM1555C1H8R2CA01D)
C43  Value 1: 100 nF  Value 2: 50V  [CAPC1608N]  (hidden comment: GRM188R71H104KA93D)
C44  Value 1: 100 nF  Value 2: 50V  [CAPC1608N]  (hidden comment: GRM188R71H104KA93D)
C45  Value 1: 100 nF  Value 2: 50V  [CAPC1608N]  (hidden comment: GRM188R71H104KA93D)
C46  Value 1: 100 nF  Value 2: 50V  [CAPC1608N]  (hidden comment: GRM188R71H104KA93D)
C47  Value 1: 100 nF  Value 2: 50V  [CAPC1608N]  (hidden comment: GRM188R71H104KA93D)
C48  Value 1: 100 nF  Value 2: 50V  [CAPC1608N]  (hidden comment: GRM188R71H104KA93D)
C49  Value 1: 100 nF  Value 2: 50V  [CAPC1608N]  (hidden comment: GRM188R71H104KA93D)
C50  Value 1: 100 nF  Value 2: 50V  [CAPC1608N]  (hidden comment: GRM188R71H104KA93D)
D3  CDSOD323-T12LC  [CDSOD323T12LC]  (value not drawn)
D4  CDSOD323-T12LC  [CDSOD323T12LC]  (value not drawn)
D5  CDSOD323-T12LC  [CDSOD323T12LC]  (value not drawn)
D6  CDSOD323-T12LC  [CDSOD323T12LC]  (value not drawn)
FB1  Value 1: 120 Ohms  [BLM18SP221SN1B]  (hidden comment: BLM18PG121SN1D)
FB2  Value 1: 120 Ohms  [BLM18SP221SN1B]  (hidden comment: BLM18PG121SN1D)
J3  691322310003  [691322310003]
J4  691322310003  [691322310003]
L3  MAF0603FAL330BT000  [BEADC0603X33N]  (value not drawn)
L4  MAF0603FAL330BT000  [BEADC0603X33N]  (value not drawn)
L5  MAF0603FAL330BT000  [BEADC0603X33N]  (value not drawn)
L6  MAF0603FAL330BT000  [BEADC0603X33N]  (value not drawn)
L7  MAF0603FAL330BT000  [BEADC0603X33N]  (value not drawn)
L8  MAF0603FAL330BT000  [BEADC0603X33N]  (value not drawn)
R32  Value 1: 10K  [RESC1608N]  (hidden comment: RN731JTTD1002F25)
R33  Value 1: 10K  [RESC1608N]  (hidden comment: RN731JTTD1002F25)
R34  Value 1: 10K  [RESC1608N]  (hidden comment: RN731JTTD1002F25)
R35  Value 1: 2K2  [RESC1608N]  (hidden comment: RN731JTTD2201F25)
R36  Value 1: 4K7  [RESC1608N]
R37  Value 1: 56R  [RESC1608N]
R38  Value 1: 120R  [RESC1608N]
R39  Value 1: 56R  [RESC1608N]
R40  Value 1: 10K  [RESC1608N]  (hidden comment: RN731JTTD1002F25)
R41  Value 1: 4K7  [RESC1608N]
R42  Value 1: 12 kΩ  [RESC1608N]  (hidden comment: ERJ-3EKF1202V)
R43  Value 1: 1K  [RESC1608N]  (hidden comment: RN731JTTD1001F25)
R44  Value 1: 10K  [RESC1608N]  (hidden comment: RN731JTTD1002F25)
R45  Value 1: 4K7  [RESC1608N]
R46  Value 1: 56R  [RESC1608N]
R47  Value 1: 120R  [RESC1608N]
R48  Value 1: 56R  [RESC1608N]
R49  Value 1: 10K  [RESC1608N]  (hidden comment: RN731JTTD1002F25)
R50  Value 1: 4K7  [RESC1608N]
TP17  Test Point  [TP]  (value not drawn)  (no BOM)
TP18  Test Point  [TP]  (value not drawn)  (no BOM)
TP19  Test Point  [TP]  (value not drawn)  (no BOM)
TP20  Test Point  [TP]  (value not drawn)  (no BOM)
TP21  Test Point  [TP]  (value not drawn)  (no BOM)
TP22  Test Point  [TP]  (value not drawn)  (no BOM)
TP23  Test Point  [TP]  (value not drawn)  (no BOM)
TP24  Test Point  [TP]  (value not drawn)  (no BOM)
U8  93C46B-I/SN  [SOIC127P600X175-8N]
U9  FT2232HL-REEL  [LQFP-64]
U10  SN75176ADR  [SOIC127P600X175-8N]
U11  SN75176ADR  [SOIC127P600X175-8N]
Y1  NX3225SA-12MHZ-STD-CSR-6  Value 1: 12Mhz  [NX3225SA]

### Ports
FTDI_USB_EN (in), USB_HUB_3 (in, harness USB_HUB_3)

### Harnesses
USB_HUB_3: USB_P3, USB_N3

### Nets
1V8: C39.2 C44.2 C45.2 C46.2 TP18.1 U9.12(VCORE) U9.37(VCORE) U9.49(VREGOUT) U9.64(VCORE)
3V3: C33.2 C38.2 C47.2 C48.2 C49.2 C50.2 FB1.1 FB2.1 R32.2 R33.2 R34.2 U8.8(VCC) U9.20(VCCIO) U9.31(VCCIO) U9.42(VCCIO) U9.50(VREGIN) U9.56(VCCIO)
5V: C40.2 C43.2 R36.2 R45.2 U10.8(VCC) U11.8(VCC)
GND: C33.1 C34.1 C35.1 C36.1 C37.1 C38.1 C39.1 C40.1 C43.1 C44.1 C45.1 C46.1 C47.1 C48.1 C49.1 C50.1 D3.2 D4.2 D5.2 D6.2 L5.1 L8.1 R40.1 R41.1 R42.1 R44.1 R49.1 R50.1 U8.5(VSS) U9.1(GND) U9.5(GND) U9.10(AGND) U9.11(GND) U9.13(TEST) U9.15(GND) U9.25(GND) U9.35(GND) U9.47(GND) U9.51(GND) U10.5(GND) U11.5(GND) Y1.2(GND_1) Y1.4(GND_2)
EECLK: R33.1 U8.2(CLK) U9.62(EECLK)
EECS: R32.1 U8.1(CS) U9.63(EECS)
EEDATA: R35.1 U8.3(DI) U9.61(EEDATA)
RS485A_EN: R40.2 TP20.1 U9.26(ACBUS0) U10.2(~{RE}) U10.3(DE)
RS485A_RX: TP17.1 U9.17(ADBUS1) U10.1(R)
RS485A_TX: TP19.1 U9.16(ADBUS0) U10.4(D)
RS485B_EN: R49.2 TP24.1 U9.48(BCBUS0) U11.2(~{RE}) U11.3(DE)
RS485B_RX: TP21.1 U9.39(BDBUS1) U11.1(R)
RS485B_TX: TP23.1 U9.38(BDBUS0) U11.4(D)
USB_RS485_N: U9.8(DP) ; port USB_HUB_3.USB_N3  [project net _D3_N]
USB_RS485_P: U9.7(DM) ; port USB_HUB_3.USB_P3  [project net _D3_P]
NetC34_2: C34.2 C36.2 FB1.2 U9.9(VPLL)
NetC35_2: C35.2 C37.2 FB2.2 U9.4(VPHY)
NetC41_1: C41.1 U9.2(OSCI)
NetC41_2: C41.2 Y1.1(CRYSTAL_1)
NetC42_1: C42.1 U9.3(OSCO)
NetC42_2: C42.2 Y1.3(CRYSTAL_2)
NetD3_1: D3.1 L3.1 R36.1 R37.2 R38.2
NetD4_1: D4.1 L4.1 R38.1 R39.2 R41.2
NetD5_1: D5.1 L6.1 R45.1 R46.2 R47.2
NetD6_1: D6.1 L7.1 R47.1 R48.2 R50.2
NetJ3_1: J3.1 L3.2
NetJ3_2: J3.2 L4.2
NetJ3_3: J3.3 L5.2
NetJ4_1: J4.1 L6.2
NetJ4_2: J4.2 L7.2
NetJ4_3: J4.3 L8.2
NetR34_1: R34.1 R35.2 U8.4(DO)
NetR37_1: R37.1 U10.6(A)
NetR39_1: R39.1 U10.7(B)
NetR42_2: R42.2 U9.6(REF)
NetR43_1: R43.1 R44.2 ; port FTDI_USB_EN
NetR43_2: R43.2 U9.14(~{RESET})
NetR46_1: R46.1 U11.6(A)
NetR48_1: R48.1 U11.7(B)
NetTP22_1: TP22.1 U9.60(~{PWREN})

Not connected (* = marked no-connect by the designer): U8 6(NC_1)* 7(NC_2)*; U9 18(ADBUS2)* 19(ADBUS3)* 21(ADBUS4)* 22(ADBUS5)* 23(ADBUS6)* 24(ADBUS7)* 27(ACBUS1)* 28(ACBUS2)* 29(ACBUS3)* 30(ACBUS4)* 32(ACBUS5)* 33(ACBUS6)* 34(ACBUS7)* 36(~{SUSPEND})* 40(BDBUS2)* 41(BDBUS3)* 43(BDBUS4)* 44(BDBUS5)* 45(BDBUS6)* 46(BDBUS7)* 52(BCBUS1)* 53(BCBUS2)* 54(BCBUS3)* 55(BCBUS4)* 57(BCBUS5)* 58(BCBUS6)* 59(BCBUS7)*

### Layout directives
differential pair; differential pair class USB_N_RS485_DIFFPAIR: _D3_N, _D3_P

### Notes on the sheet
- RS-485
- Author : Mohamed Gueni
- mohamedgueni@outlook.com
- 1/11
- R0
- Title:
- Micro Device Tunisie
- Size:
- Date:
- File:
- A3
- Engineer :
- Revision:
- Sheet
- of
- Cyber Parc  Hammam Sousse
- Avenue Charles De Gaulle
- 4011, Hammam-Sousse, Tunisie
- contact@mdtunisie.com
- (in symbol GIC-000000005) FT2232HL

### Library data of the parts
C33 C36-C38 C40 C43-C50 = CAP-000000017: as C80 on sheet CELLULAR; Part Number: CAP-000000017; MANREF: GRM188R71H104KA93D
C34 C35 = CAP-000000021: MAN: Murata; DES: Ceramic Capacitor, 4.7 µF, 50V, X5R, 0603; FTP: 603; SUPREF: 81-GRM188R61H475KE11D; Part Number: CAP-000000021; MANREF: GRM188R61H475KE11D
C39 = CAP-000000008: FTP: 0603; Part Number: CAP-000000008
C41 C42 = CAP-000000013: as C84 on sheet CELLULAR; Part Number: CAP-000000013; MANREF: GRM1555C1H8R2CA01D
D3-D6 = TVS-000000003: as D11 on sheet CELLULAR; Part Number: TVS-000000003; MANREF: CDSOD323-T12LC; NOTE: _
FB1 FB2 = F-000000001: MAN: Murata Electronics; DES: Ferrite Beads 120 OHM 25% Alternate Sizing Guide Below; Value 2: 2 A; TOL: 25 %; FTP: F0603; SUP: Mouser; SUPREF: 81-BLM18PG121SN1D; NOTE: _; Part Number: F-000000001; MANREF: BLM18PG121SN1D
J3 J4 = CON-000000011: MAN: Wurth Elektronik; DES: Pluggable Terminal Blocks WR-TBL 300VAC 10A 3P Right Angle; Value 1: _; FTP: THT; SUP: Mouser; SUPREF: 710-691322310003; Part Number: CON-000000011; MANREF: 691322310003; Value 2: _; TOL: _; NOTE: _
L3-L8 = IND-000000006: MAN: TDK; DES: Common Mode Chokes / Filters 0603 33ohm 200mA; SUP: Mouser; SUPREF: 810-MAF0603FAL330BT0; Part Number: IND-000000006; MANREF: MAF0603FAL330BT000
R32-R34 R40 R44 R49 = RES-000000007: MAN: KOA Speer; DES: Thin Film Resistors - SMD 10kOhm,0603,1%,25ppm ,63mW,50V; Value 2: 0.63W; TOL: 1%; FTP: 0603; SUP: Mouser; SUPREF: 660-RN731JTTD1002F25; NOTE: _; Part Number: RES-000000007; MANREF: RN731JTTD1002F25
R35 = RES-000000006: MAN: KOA Speer; DES: Thin Film Resistors - SMD 2.2kOhm,0603,1%,25pp m,63mW,50V; Value 2: 0.1W; TOL: 1%; FTP: 0603; SUP: Mouser; SUPREF: 660-RN731JTTD2201F25; NOTE: _; Part Number: RES-000000006; MANREF: RN731JTTD2201F25
R36 R41 R45 R50 = RES-000000010: FTP: 0603; SUP: Mouser; NOTE: _; Part Number: RES-000000010
R37 R39 R46 R48 = RES-000000012: FTP: 0603; SUP: Mouser; NOTE: _; Part Number: RES-000000012
R38 R47 = RES-000000013: FTP: 0603; SUP: Mouser; NOTE: _; Part Number: RES-000000013
R42 = RES-0000000011: as R81 on sheet USB HUB; Part Number: RES-0000000011; MANREF: ERJ-3EKF1202V
R43 = RES-000000001: as R101 on sheet CELLULAR; Part Number: RES-000000001; MANREF: RN731JTTD1001F25
TP17-TP24 = MIS-000000002: MAN: _; Part Number: MIS-000000002; MANREF: _; DES: _; Value 1: _; Value 2: _; TOL: _; FTP: _; SUP: _; SUPREF: _; NOTE: _
U8 = GIC-000000012: MAN: Microchip Technology; DES: EEPROM 64x16; Value 1: _; FTP: SOIC-8; SUP: Mouser; SUPREF: 579-93C46B-I/SN; Part Number: GIC-000000012; MANREF: 93C46B-I/SN; Value 2: _; TOL: _; NOTE: _
U9 = GIC-000000005: MAN: FTDI; DES: USB Interface IC USB HS to Dual UART/ FIFO/SPI/JTAG/I2C; Value 1: 3.3 V; Value 2: 70 mA; TOL: _; SUP: Mouser; SUPREF: 895-FT2232HL; Part Number: GIC-000000005; MANREF: FT2232HL-REEL; FTP: LQFP-64; NOTE: _
U10 U11 = GIC-000000013: MAN: Texas Instruments; DES: RS-422/RS-485 Interface IC Differential Bus Tra ns A 595-SN75176AD; TOL: _; FTP: SOIC-8; SUP: Mouser; SUPREF: 595-SN75176ADR; Part Number: GIC-000000013; MANREF: SN75176ADR; NOTE: _
Y1 = Y-000000002: MAN: NDK; DES: Crystals CRYSTAL 12MHZ 8PF SMD; FTP: _; SUP: Mouser; SUPREF: 344-NX3225SA12MCSR6; Part Number: Y-000000002; MANREF: NX3225SA-12MHZ-STD-CSR-6; NOTE: _

## Sheet SD-CARD.SchDoc: SD-CARD
size A3; Engineer: M.GUENI; Revision: R0; SheetNumber: 06; SheetTotal: 10
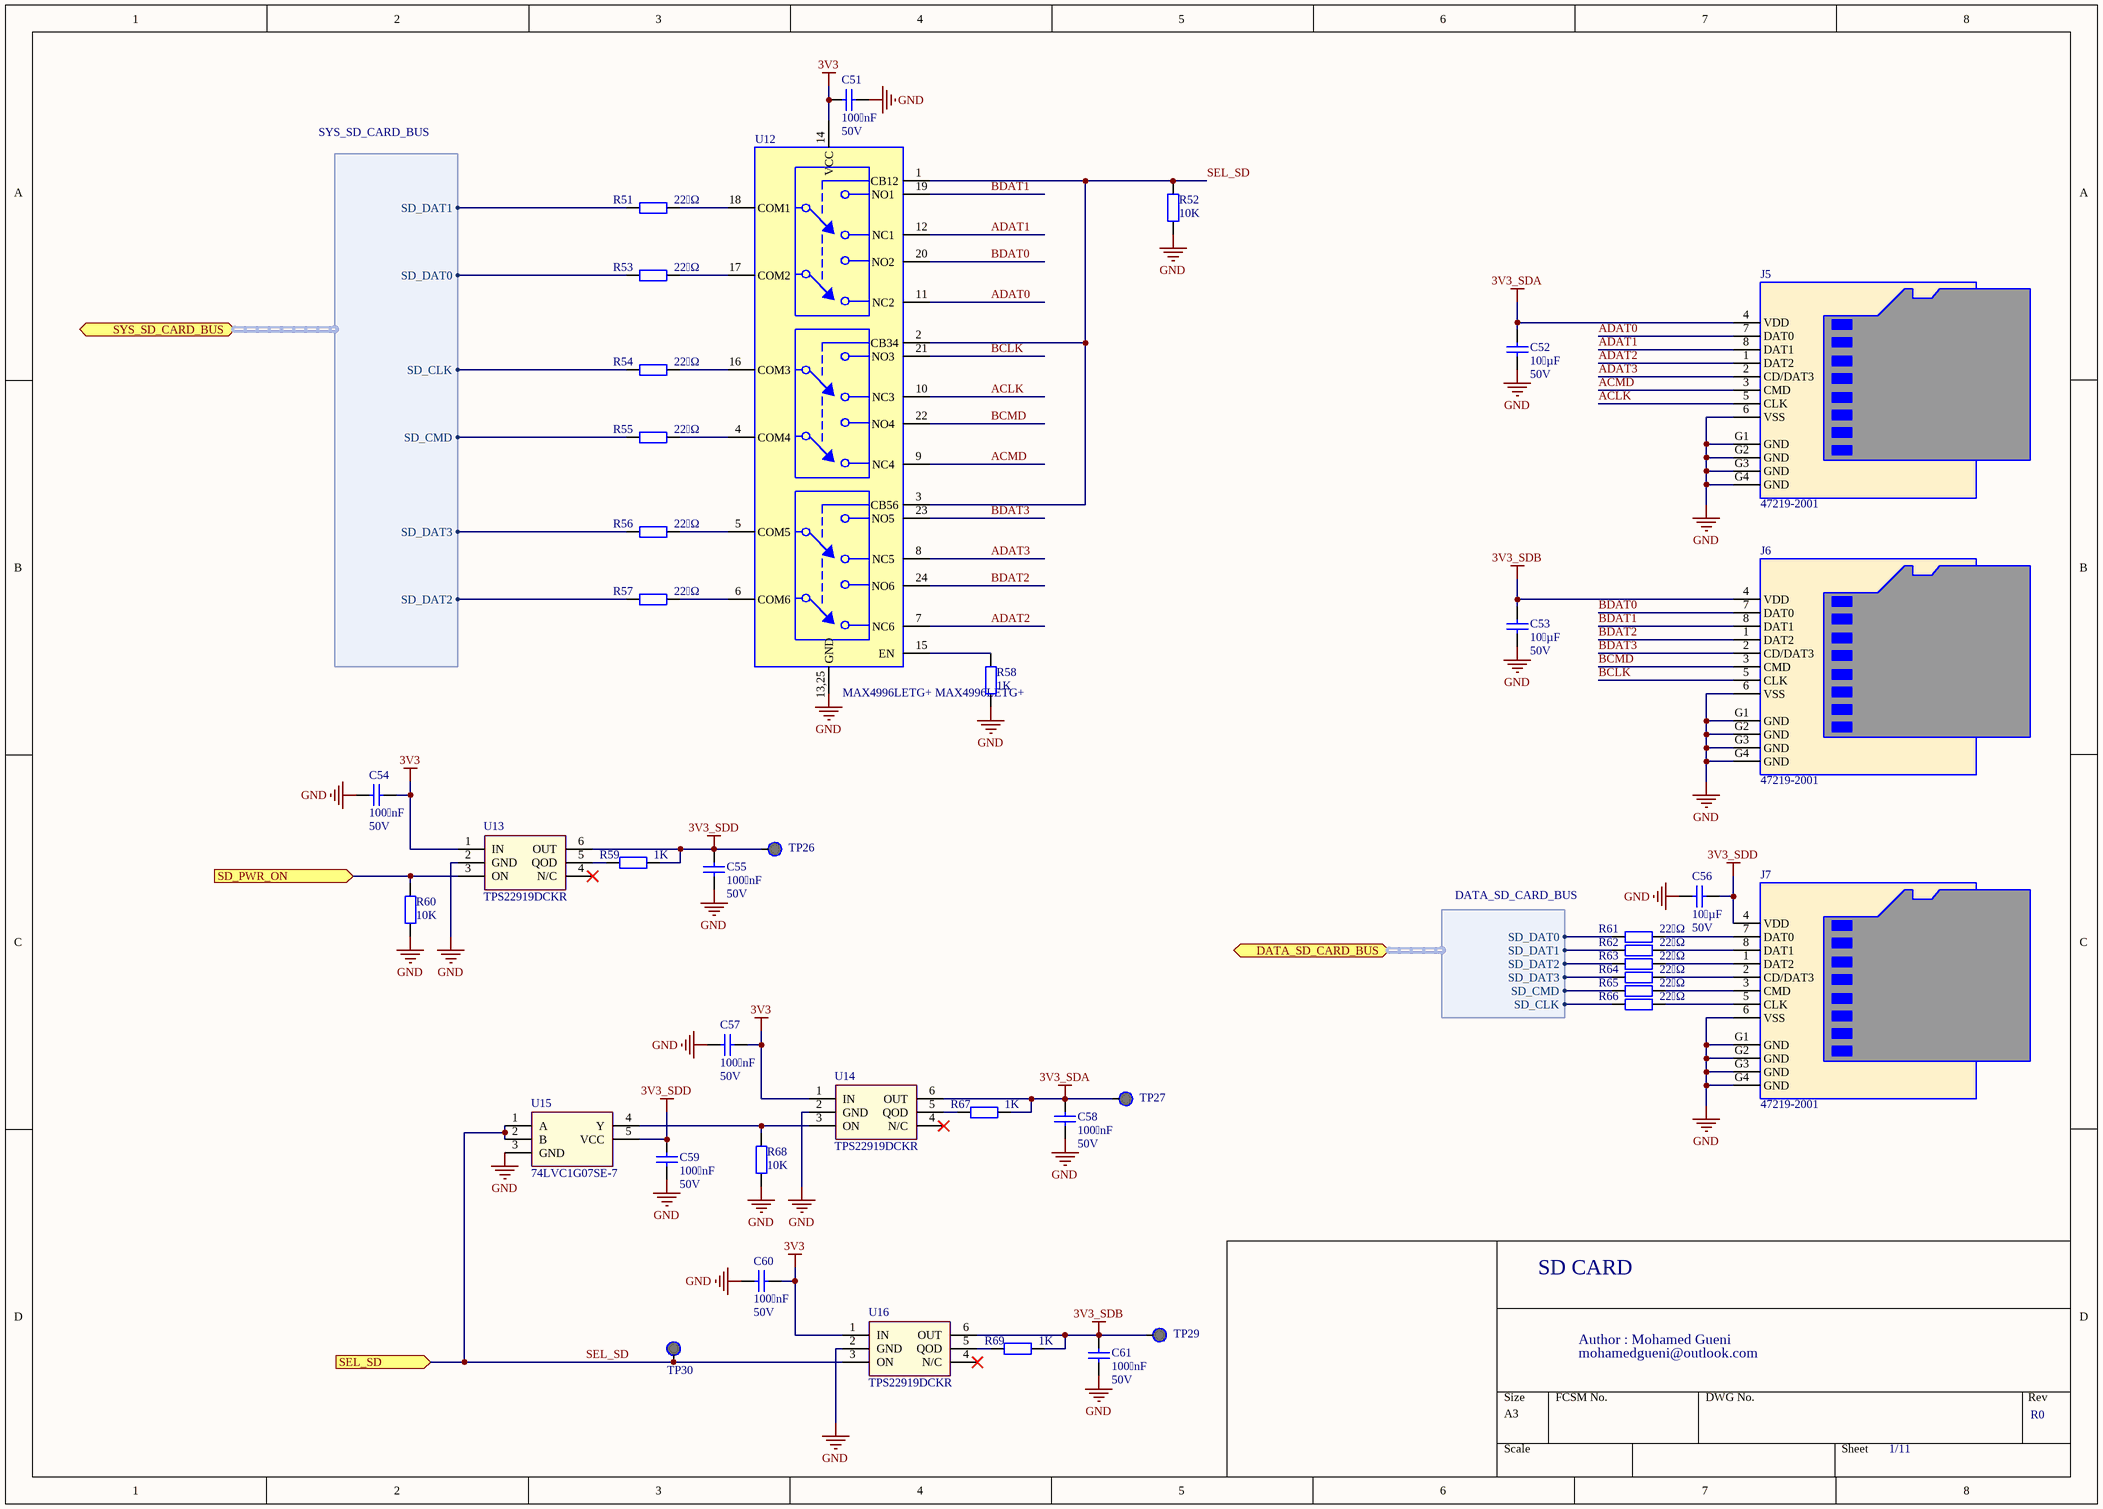
[diagram p8: SD-CARD.SchDoc]

### Parts
C51  Value 1: 100 nF  Value 2: 50V  [CAPC1608N]  (hidden comment: GRM188R71H104KA93D)
C52  Value 1: 10 µF  Value 2: 50V  [CAPC1608N]  (hidden comment: GRM188R61H106KAALD)
C53  Value 1: 10 µF  Value 2: 50V  [CAPC1608N]  (hidden comment: GRM188R61H106KAALD)
C54  Value 1: 100 nF  Value 2: 50V  [CAPC1608N]  (hidden comment: GRM188R71H104KA93D)
C55  Value 1: 100 nF  Value 2: 50V  [CAPC1608N]  (hidden comment: GRM188R71H104KA93D)
C56  Value 1: 10 µF  Value 2: 50V  [CAPC1608N]  (hidden comment: GRM188R61H106KAALD)
C57  Value 1: 100 nF  Value 2: 50V  [CAPC1608N]  (hidden comment: GRM188R71H104KA93D)
C58  Value 1: 100 nF  Value 2: 50V  [CAPC1608N]  (hidden comment: GRM188R71H104KA93D)
C59  Value 1: 100 nF  Value 2: 50V  [CAPC1608N]  (hidden comment: GRM188R71H104KA93D)
C60  Value 1: 100 nF  Value 2: 50V  [CAPC1608N]  (hidden comment: GRM188R71H104KA93D)
C61  Value 1: 100 nF  Value 2: 50V  [CAPC1608N]  (hidden comment: GRM188R71H104KA93D)
J5  47219-2001  [MOLEX-SD-47219]
J6  47219-2001  [MOLEX-SD-47219]
J7  47219-2001  [MOLEX-SD-47219]
R51  Value 1: 22 Ω  [RESC1608N]  (hidden comment: ERJ-3EKF22R0V)
R52  Value 1: 10K  [RESC1608N]  (hidden comment: RN731JTTD1002F25)
R53  Value 1: 22 Ω  [RESC1608N]  (hidden comment: ERJ-3EKF22R0V)
R54  Value 1: 22 Ω  [RESC1608N]  (hidden comment: ERJ-3EKF22R0V)
R55  Value 1: 22 Ω  [RESC1608N]  (hidden comment: ERJ-3EKF22R0V)
R56  Value 1: 22 Ω  [RESC1608N]  (hidden comment: ERJ-3EKF22R0V)
R57  Value 1: 22 Ω  [RESC1608N]  (hidden comment: ERJ-3EKF22R0V)
R58  Value 1: 1K  [RESC1608N]  (hidden comment: RN731JTTD1001F25)
R59  Value 1: 1K  [RESC1608N]  (hidden comment: RN731JTTD1001F25)
R60  Value 1: 10K  [RESC1608N]  (hidden comment: RN731JTTD1002F25)
R61  Value 1: 22 Ω  [RESC1608N]  (hidden comment: ERJ-3EKF22R0V)
R62  Value 1: 22 Ω  [RESC1608N]  (hidden comment: ERJ-3EKF22R0V)
R63  Value 1: 22 Ω  [RESC1608N]  (hidden comment: ERJ-3EKF22R0V)
R64  Value 1: 22 Ω  [RESC1608N]  (hidden comment: ERJ-3EKF22R0V)
R65  Value 1: 22 Ω  [RESC1608N]  (hidden comment: ERJ-3EKF22R0V)
R66  Value 1: 22 Ω  [RESC1608N]  (hidden comment: ERJ-3EKF22R0V)
R67  Value 1: 1K  [RESC1608N]  (hidden comment: RN731JTTD1001F25)
R68  Value 1: 10K  [RESC1608N]  (hidden comment: RN731JTTD1002F25)
R69  Value 1: 1K  [RESC1608N]  (hidden comment: RN731JTTD1001F25)
TP26  Test Point  [TP]  (value not drawn)  (no BOM)
TP27  Test Point  [TP]  (value not drawn)  (no BOM)
TP29  Test Point  [TP]  (value not drawn)  (no BOM)
TP30  Test Point  [TP]  (value not drawn)  (no BOM)
U12  MAX4996LETG+ / MAX4996LETG+  [TQFN-24]
U13  TPS22919DCKR  [SC70-TPS22919DCKR6]
U14  TPS22919DCKR  [SC70-TPS22919DCKR6]
U15  74LVC1G07SE-7  [SOT-353]
U16  TPS22919DCKR  [SC70-TPS22919DCKR6]

### Ports
DATA_SD_CARD_BUS (bidir, harness DATA_SD_CARD_BUS), SD_PWR_ON (in), SEL_SD (in), SYS_SD_CARD_BUS (bidir, harness SYS_SD_CARD_BUS)

### Harnesses
SYS_SD_CARD_BUS: SD_DAT0, SD_DAT1, SD_CMD, SD_CLK, SD_DAT2, SD_DAT3
DATA_SD_CARD_BUS: SD_DAT1, SD_DAT0, SD_DAT3, SD_DAT2, SD_CLK, SD_CMD

### Nets
3V3: C51.1 C54.1 C57.1 C60.1 U12.14(VCC) U13.1(IN) U14.1(IN) U16.1(IN)
3V3_SDA: C52.2 C58.1 J5.4(VDD) R67.1 TP27.1 U14.6(OUT)
3V3_SDB: C53.2 C61.1 J6.4(VDD) R69.1 TP29.1 U16.6(OUT)
3V3_SDD: C55.1 C56.2 C59.1 J7.4(VDD) R59.1 TP26.1 U13.6(OUT) U15.5(VCC)
GND: C51.2 C52.1 C53.1 C54.2 C55.2 C56.1 C57.2 C58.2 C59.2 C60.2 C61.2 J5.6(VSS) J5.G1(GND) J5.G2(GND) J5.G3(GND) J5.G4(GND) J6.6(VSS) J6.G1(GND) J6.G2(GND) J6.G3(GND) J6.G4(GND) J7.6(VSS) J7.G1(GND) J7.G2(GND) J7.G3(GND) J7.G4(GND) R52.1 R58.1 R60.1 R68.1 U12.13,25(GND) U13.2(GND) U14.2(GND) U15.3(GND) U16.2(GND)
ACLK: J5.5(CLK) U12.10(NC3)
ACMD: J5.3(CMD) U12.9(NC4)
ADAT0: J5.7(DAT0) U12.11(NC2)
ADAT1: J5.8(DAT1) U12.12(NC1)
ADAT2: J5.1(DAT2) U12.7(NC6)
ADAT3: J5.2(CD/DAT3) U12.8(NC5)
BCLK: J6.5(CLK) U12.21(NO3)
BCMD: J6.3(CMD) U12.22(NO4)
BDAT0: J6.7(DAT0) U12.20(NO2)
BDAT1: J6.8(DAT1) U12.19(NO1)
BDAT2: J6.1(DAT2) U12.24(NO6)
BDAT3: J6.2(CD/DAT3) U12.23(NO5)
SEL_SD: R52.2 TP30.1 U12.1(CB12) U12.2(CB34) U12.3(CB56) U15.1(A) U15.2(B) U16.3(ON) ; port SEL_SD
NetJ7_1: J7.1(DAT2) R63.2
NetJ7_2: J7.2(CD/DAT3) R64.2
NetJ7_3: J7.3(CMD) R65.2
NetJ7_5: J7.5(CLK) R66.2
NetJ7_7: J7.7(DAT0) R61.2
NetJ7_8: J7.8(DAT1) R62.2
NetR51_1: R51.1 ; port SYS_SD_CARD_BUS.SD_DAT1
NetR51_2: R51.2 U12.18(COM1)
NetR53_1: R53.1 ; port SYS_SD_CARD_BUS.SD_DAT0
NetR53_2: R53.2 U12.17(COM2)
NetR54_1: R54.1 ; port SYS_SD_CARD_BUS.SD_CLK
NetR54_2: R54.2 U12.16(COM3)
NetR55_1: R55.1 ; port SYS_SD_CARD_BUS.SD_CMD
NetR55_2: R55.2 U12.4(COM4)
NetR56_1: R56.1 ; port SYS_SD_CARD_BUS.SD_DAT3
NetR56_2: R56.2 U12.5(COM5)
NetR57_1: R57.1 ; port SYS_SD_CARD_BUS.SD_DAT2
NetR57_2: R57.2 U12.6(COM6)
NetR58_2: R58.2 U12.15(EN)
NetR59_2: R59.2 U13.5(QOD)
NetR60_2: R60.2 U13.3(ON) ; port SD_PWR_ON
NetR61_1: R61.1 ; port DATA_SD_CARD_BUS.SD_DAT0
NetR62_1: R62.1 ; port DATA_SD_CARD_BUS.SD_DAT1
NetR63_1: R63.1 ; port DATA_SD_CARD_BUS.SD_DAT2
NetR64_1: R64.1 ; port DATA_SD_CARD_BUS.SD_DAT3
NetR65_1: R65.1 ; port DATA_SD_CARD_BUS.SD_CMD
NetR66_1: R66.1 ; port DATA_SD_CARD_BUS.SD_CLK
NetR67_2: R67.2 U14.5(QOD)
NetR68_2: R68.2 U14.3(ON) U15.4(Y)
NetR69_2: R69.2 U16.5(QOD)

Not connected (* = marked no-connect by the designer): U13 4(N/C)*; U14 4(N/C)*; U16 4(N/C)*

### Notes on the sheet
- SD CARD
- Author : Mohamed Gueni
- mohamedgueni@outlook.com
- 1/11
- R0
- Title:
- Micro Device Tunisie
- Size:
- Date:
- File:
- A3
- Engineer :
- Revision:
- Sheet
- of
- Cyber Parc  Hammam Sousse
- Avenue Charles De Gaulle
- 4011, Hammam-Sousse, Tunisie
- contact@mdtunisie.com

### Library data of the parts
C51 C54 C55 C57-C61 = CAP-000000017: as C80 on sheet CELLULAR; Part Number: CAP-000000017; MANREF: GRM188R71H104KA93D
C52 C53 C56 = CAP-000000025: MAN: Murata; DES: Ceramic Capacitor, 10 µF, 50V, X5R, 0603; FTP: 603; SUPREF: 81-GRM188R61H106KAALD; Part Number: CAP-000000025; MANREF: GRM188R61H106KAALD
J5-J7 = CON-000000001: MAN: Molex; DES: Memory Card Connectors TFR READER (HINGE TYPE); Value 1: 1.1 mm; Value 2: 500 mA; TOL: _; FTP: SMT; SUP: Mouser; SUPREF: 538-47219-2001; Part Number: CON-000000001; MANREF: 47219-2001; NOTE: _
R51 R53-R57 R61-R66 = RES-0000000019: as R74 on sheet USB HUB; Part Number: RES-0000000019; MANREF: ERJ-3EKF22R0V
R52 R60 R68 = RES-000000007: as R32 on sheet RS-485; Part Number: RES-000000007; MANREF: RN731JTTD1002F25
R58 R59 R67 R69 = RES-000000001: as R101 on sheet CELLULAR; Part Number: RES-000000001; MANREF: RN731JTTD1001F25
TP26 TP27 TP29 TP30 = MIS-000000002: MAN: _; Part Number: MIS-000000002; MANREF: _; DES: _; Value 1: _; Value 2: _; TOL: _; FTP: _; SUP: _; SUPREF: _; NOTE: _
U12 = GIC-000000001: MAN: Maxim Integrated; DES: Analogue Switch ICs Triple DPDT, Low-Capacitance Data Switches; Value 1: 5.5 V; Value 2: 10 uA; TOL: _; SUP: Mouser; SUPREF: 700-MAX4996LETG; Part Number: GIC-000000001; MANREF: MAX4996LETG+ / MAX4996LETG+; FTP: TQFN-24; NOTE: _
U13 U14 U16 = ICP-000000002: MAN: Texas Instruments; DES: Power Switch ICs - Power Distribution 5.5-V 1.5-A 90-moh m load switch with a A 595-TPS22919DCKT; Value 1: 1.5 A; Value 2: 1.6 V to 5.5 V; TOL: _; FTP: SC70-6; SUP: Mouser; SUPREF: 595-TPS22919DCKR; Part Number: ICP-000000002; MANREF: TPS22919DCKR; NOTE: -
U15 = GIC-000000008: MAN: Diodes Incorporated; DES: Buffers & Line Drivers Single Gate Open Out 1.65 to 5.5V 32mA; Value 1: 5.5 V; Value 2: 32 mA; TOL: _; SUP: Mouser; SUPREF: 621-74LVC1G07SE-7; Part Number: GIC-000000008; MANREF: 74LVC1G07SE-7; FTP: SOT-353; NOTE: _